# EasyEDA Pro project FrameworkGPU to MXM V0.31.epro, board V0.4
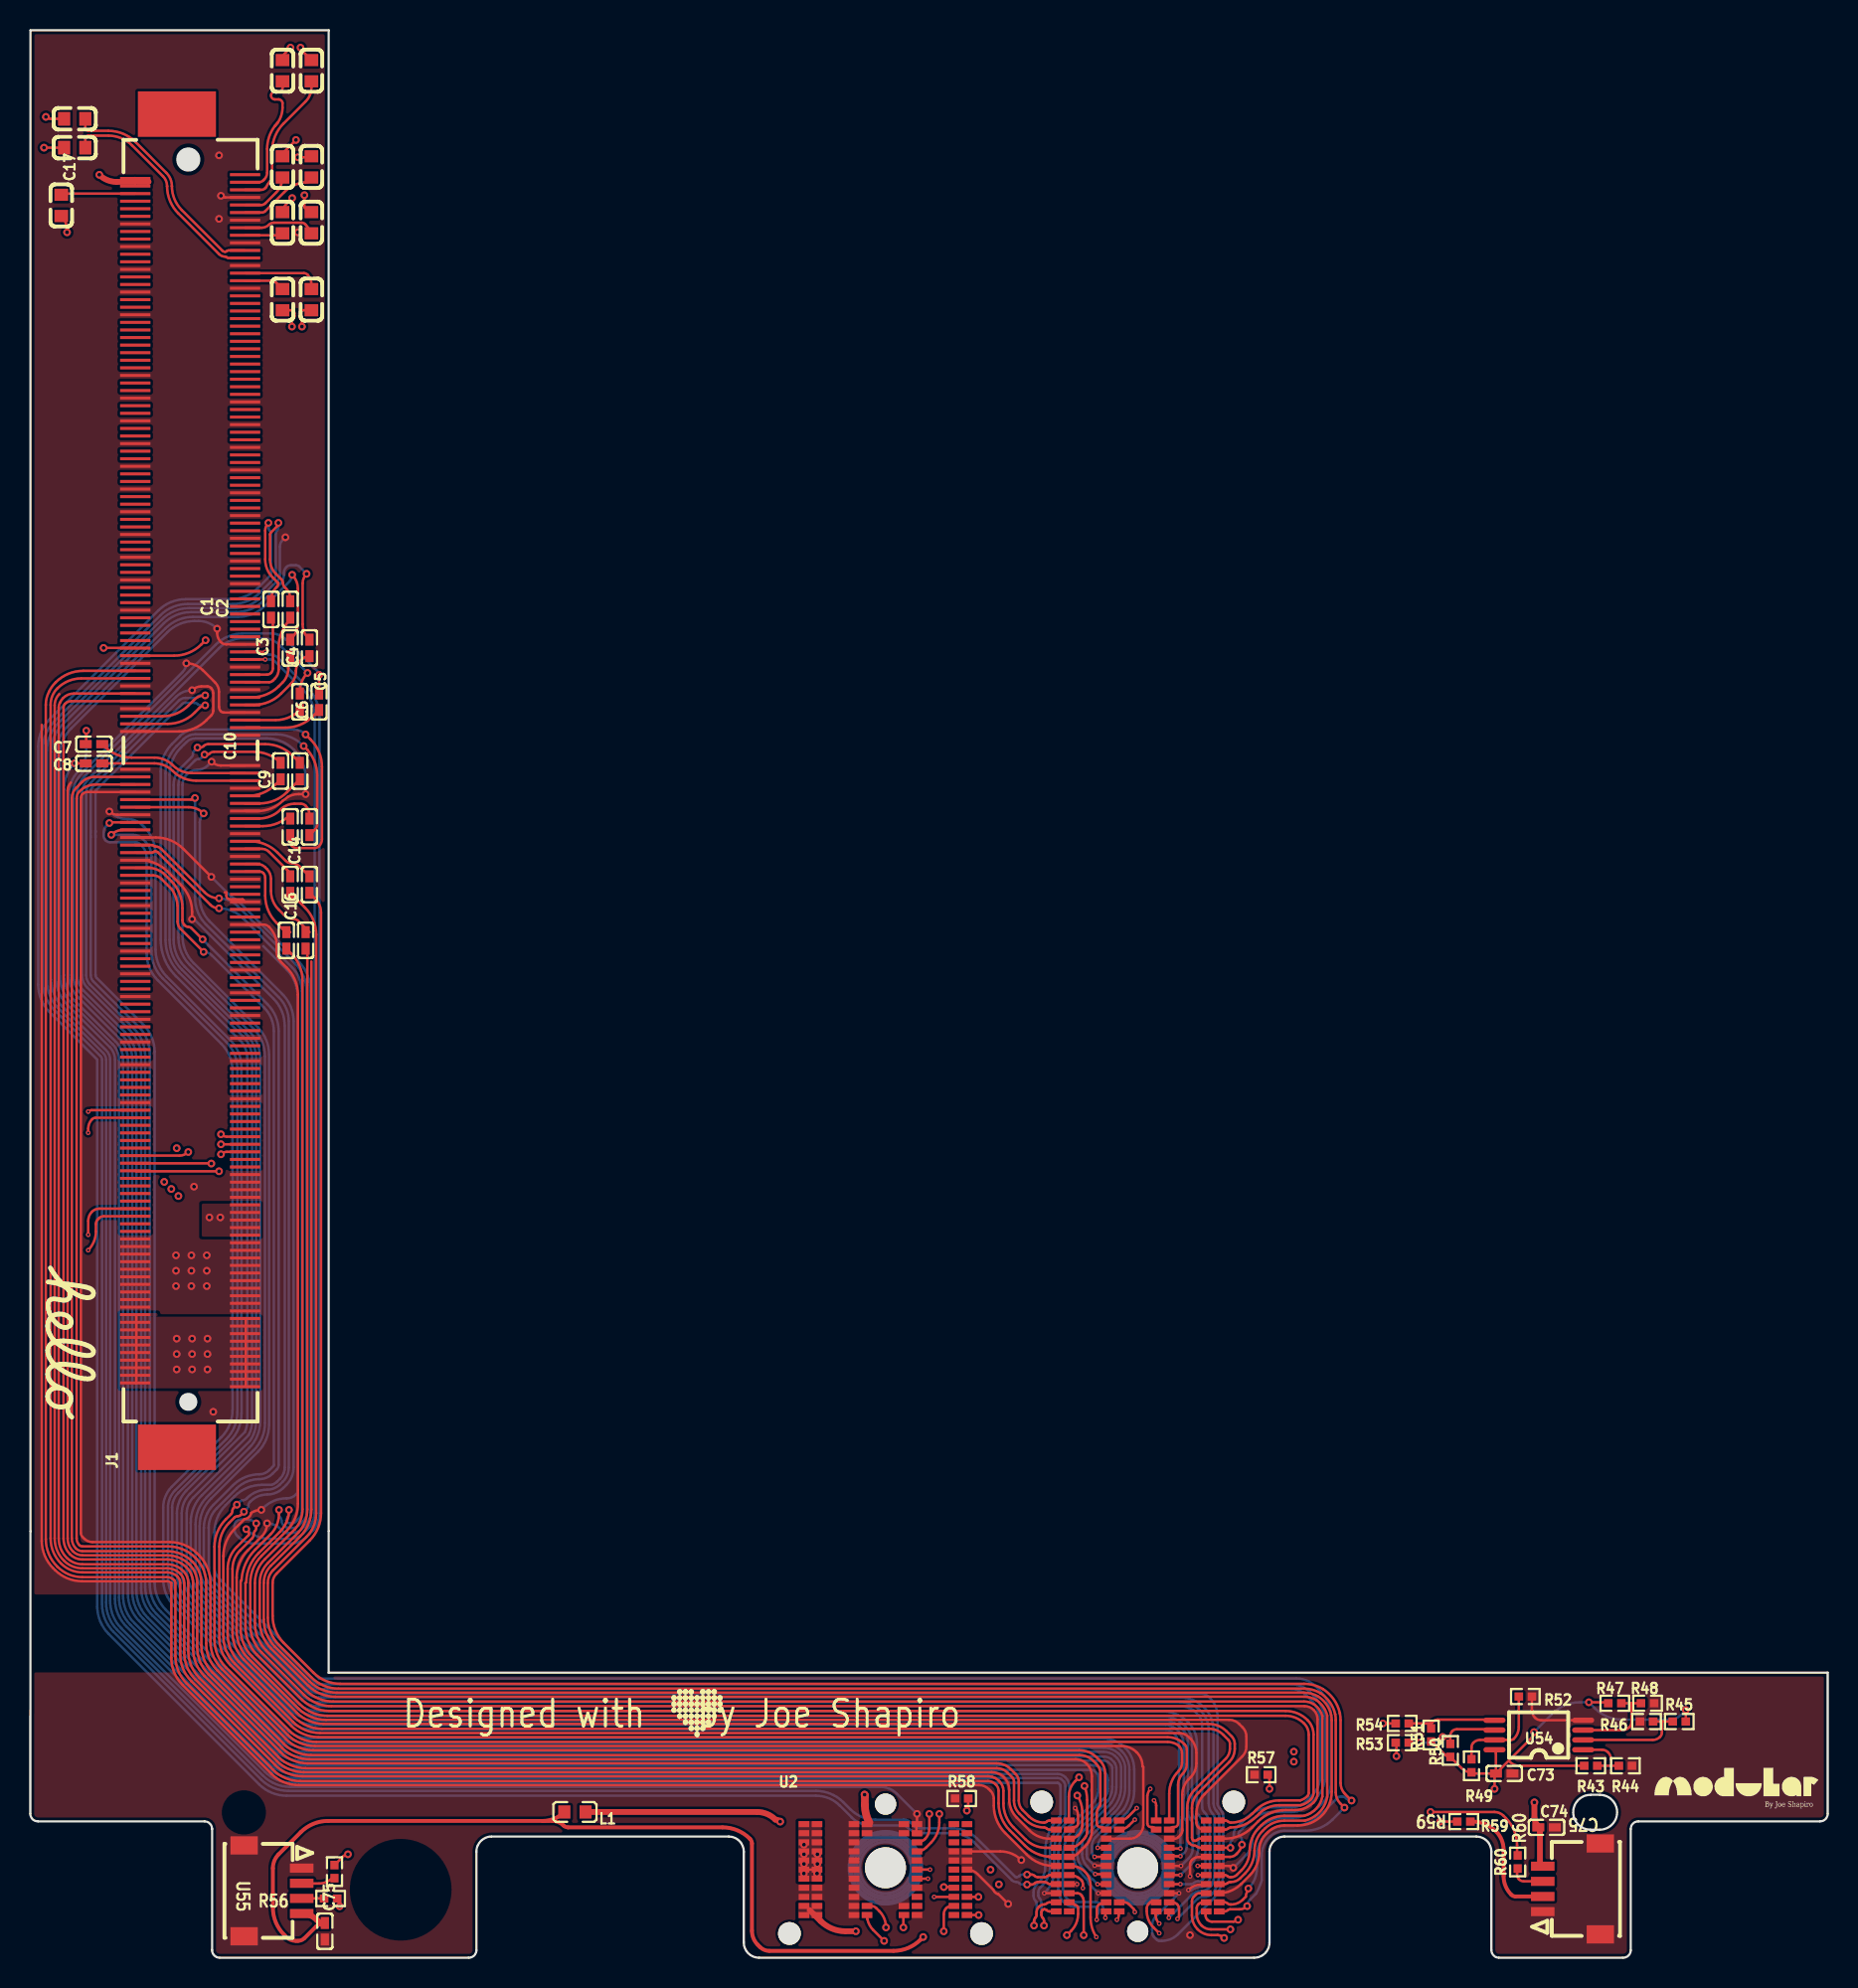
[diagram p7: board, top side]
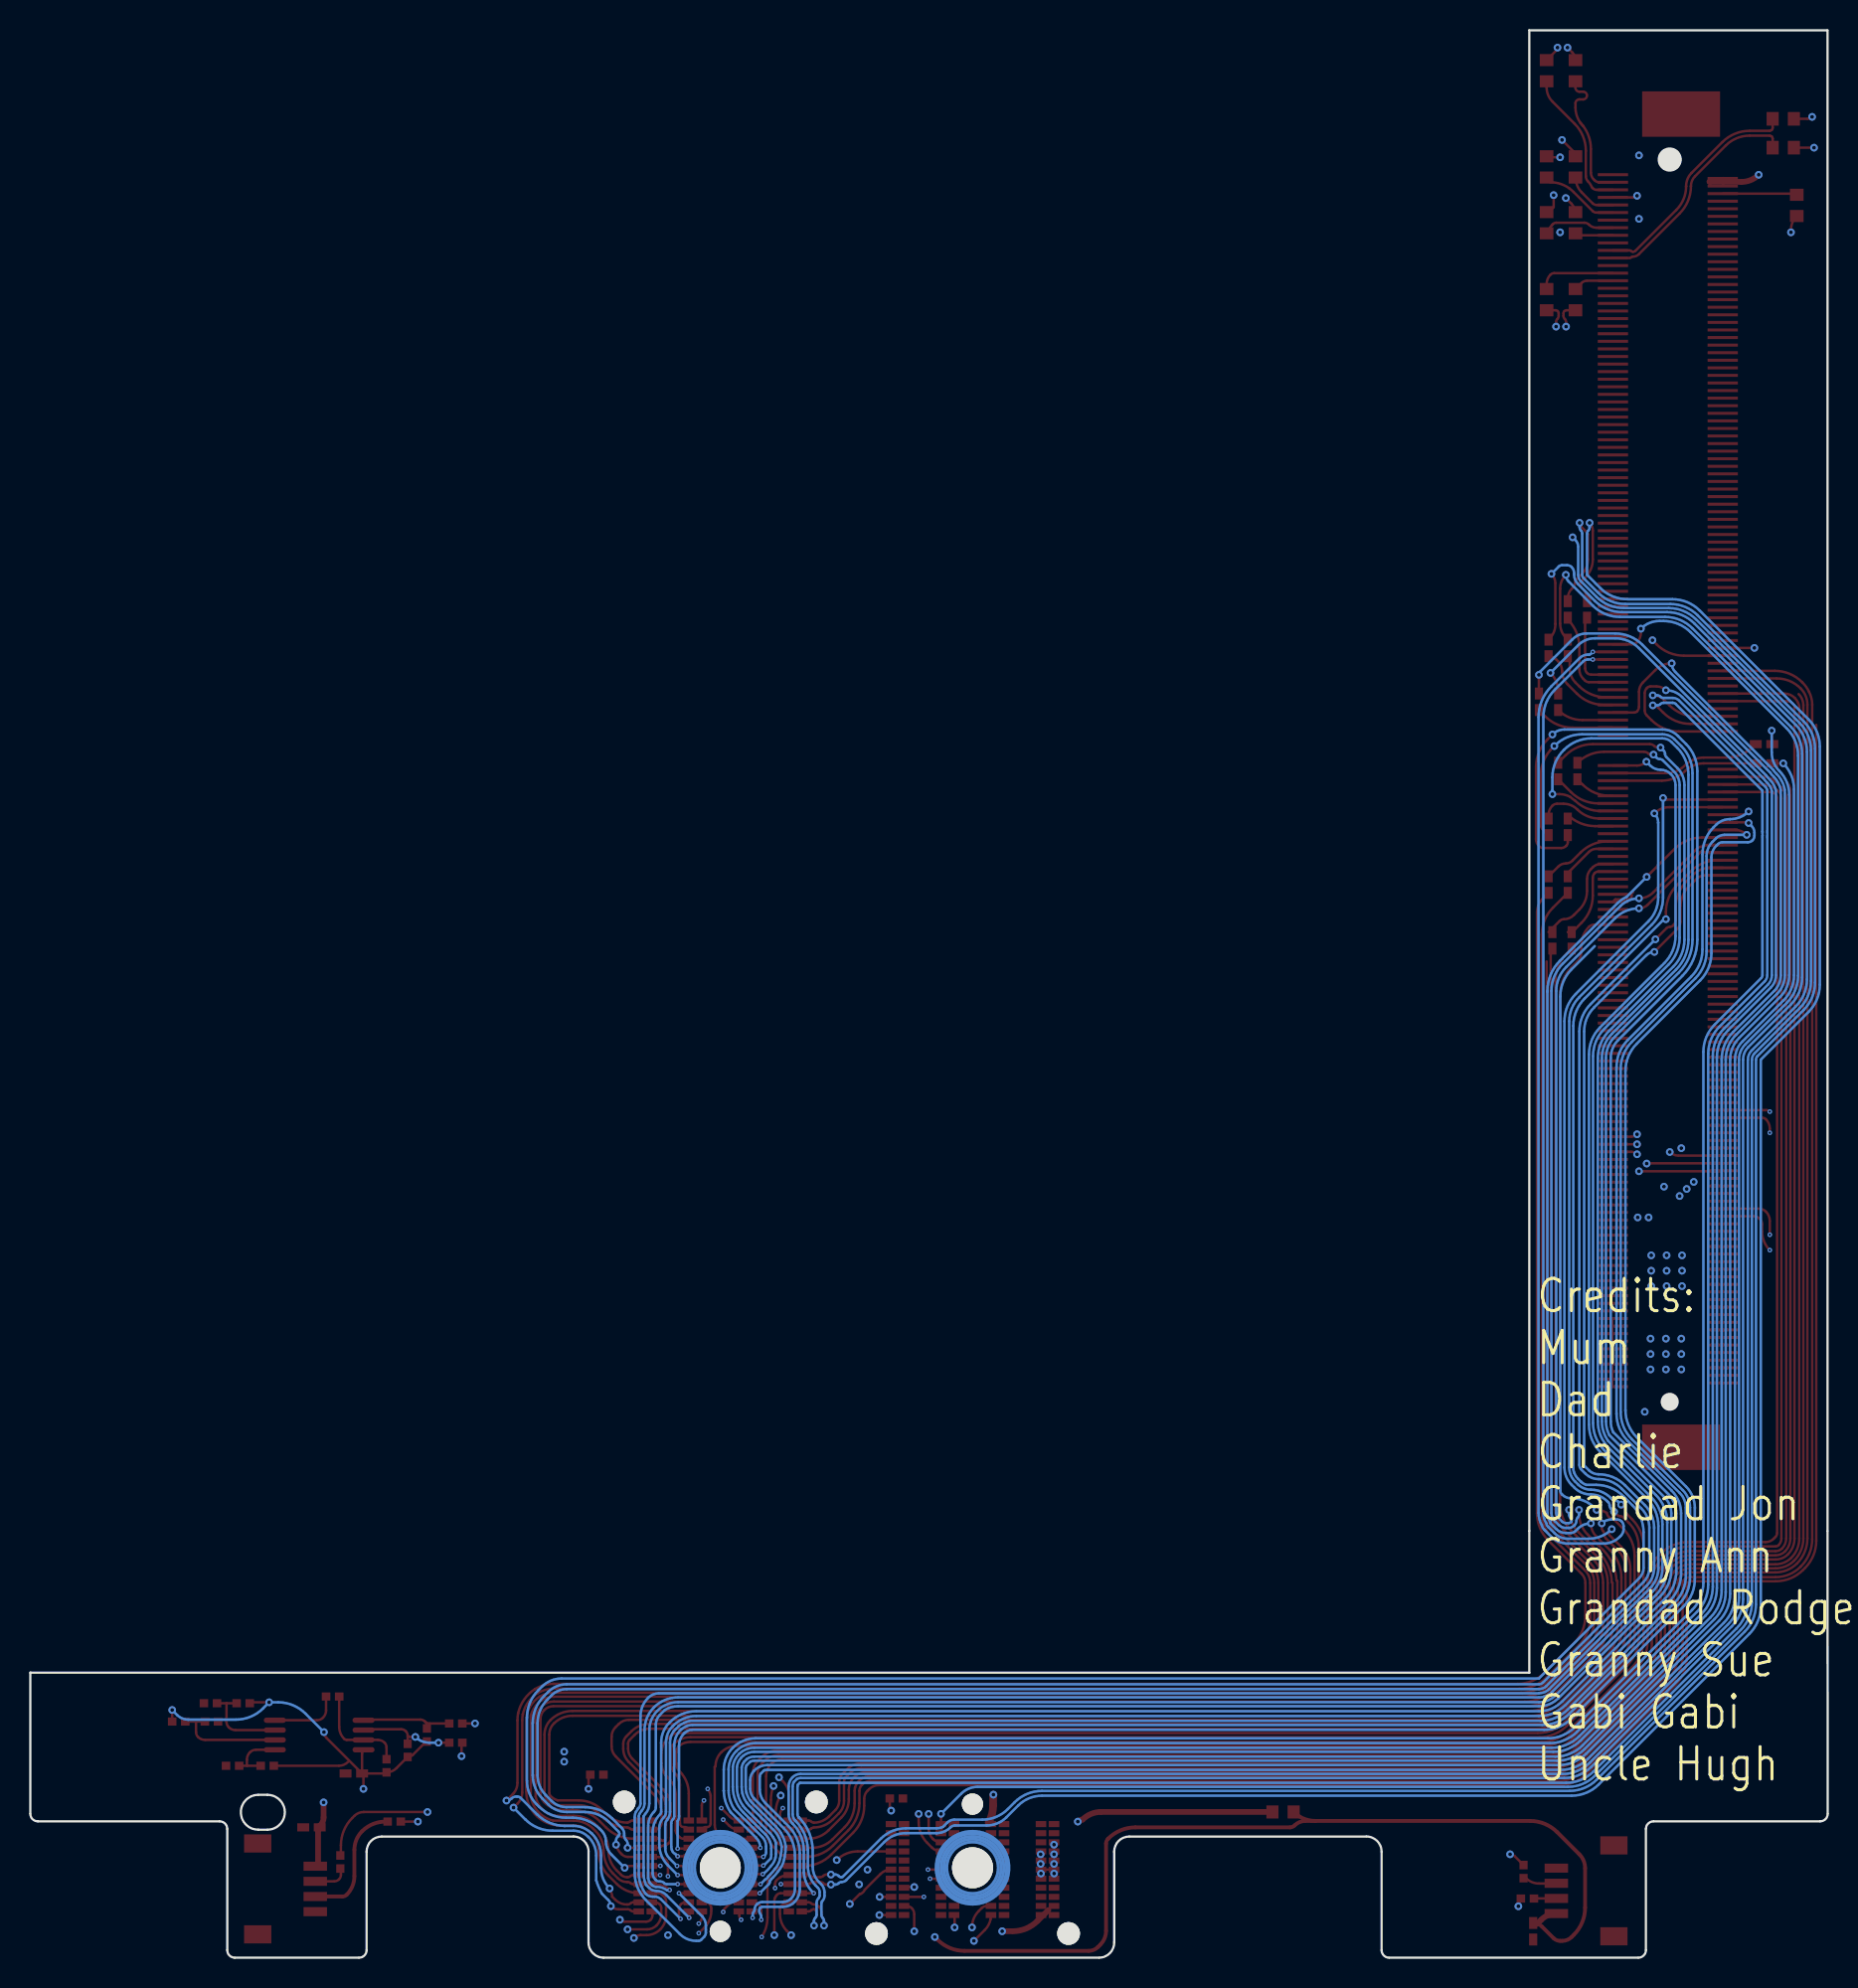
[diagram p8: board, bottom side, seen from below]

Outline 118.65 x 127.22 mm; copper layers: Top Layer, Inner2, Inner3, Bottom Layer. Coordinates in mm from the lower left corner of the outline.
Outline path: 0.01,127.22 0.01,28.16 0,9.5 arc(0.15,9.15) 0.5,9 11.5,9 arc(11.85,8.85) 12,8.5 12,0.5 arc(12.15,0.15) 12.5,0 28.95,0 arc(29.3,0.15) 29.45,0.5 29.45,7 arc(29.74,7.71) 30.45,8 46.1,8 arc(46.81,7.71) 47.1,7 47.1,1 arc(47.39,0.29) 48.1,0 80.8,0 arc(81.51,0.29) 81.8,1 81.8,7 arc(82.09,7.71) 82.8,8 95.45,8 arc(96.16,7.71) 96.45,7 96.45,0.5 arc(96.6,0.15) 96.95,0 105.15,0 arc(105.5,0.15) 105.65,0.5 105.65,8.5 arc(105.8,8.85) 106.15,9 118.15,9 arc(118.5,9.15) 118.65,9.5 118.65,18.82 19.7,18.82 arc(19.7,18.82) 19.7,18.82 19.7,127.22 0.01,127.22 ; 103,8.45 arc(101.85,9.6) 103,10.75 103.6,10.75 arc(104.75,9.6) 103.6,8.45 103,8.45
Stack: Top Layer 0.035mm / Dielectric1 0.48mm PP er 4.5 / Inner2 0.035mm / Dielectric2 0.48mm FR4 er 4.5 / Inner3 0.035mm / Dielectric3 0.48mm PP er 4.5 / Bottom Layer 0.035mm

## Design rules (mm)
net PCIE_TX_0P: PCIE_TX_0
net $1N3808: DP1
net PCIE_TX_0N: PCIE_TX_0
net $1N3802: DP1
net PCIE_TX_1P: PCIE_TX_1
net PCIE_TX_1N: PCIE_TX_1
net PCIE_TX_2P: PCIE_TX_2
net PCIE_TX_2N: PCIE_TX_2
net PCIE_TX_3P: PCIE_TX_3
net PCIE_TX_3N: PCIE_TX_3
net PCIE_TX_4P: PCIE_TX_4
net PCIE_TX_4N: PCIE_TX_4
net PCIE_TX_5P: PCIE_TX_5
net PCIE_TX_5N: PCIE_TX_5
net PCIE_TX_6P: PCIE_TX_6
net PCIE_TX_6N: PCIE_TX_6
net PCIE_TX_7P: PCIE_TX_7
net PCIE_TX_7N: PCIE_TX_7
net $1N13376: DP6
net DP_A_AUXP: DP_A_AUX
net $1N13406: DP6
net DP_A_AUXN: DP_A_AUX
net $1N13436: DP5
net DP_A_L3P: DP_A_L3
net $1N13548: DP5
net DP_A_L3N: DP_A_L3
net $1N13542: DP3
net DP_A_L2P: DP_A_L2
net $1N13608: DP3
net DP_A_L2N: DP_A_L2
net DP_A_L1P: DP_A_L1
net DP_A_L1N: DP_A_L1
net $1N13662: DP4
net DP_A_L0P: DP_A_L0
net $1N13722: DP4
net DP_A_L0N: DP_A_L0
net PEX_REFCLK+: DP2
net PEX_REFCLK-: DP2
net PCIE_RX_0P: PCIE_RX_0
net PCIE_RX_0N: PCIE_RX_0
net PCIE_RX_1P: PCIE_RX_1
net PCIE_RX_1N: PCIE_RX_1
net PCIE_RX_2P: PCIE_RX_2
net PCIE_RX_2N: PCIE_RX_2
net PCIE_RX_3P: PCIE_RX_3
net PCIE_RX_3N: PCIE_RX_3
net PCIE_RX_4P: PCIE_RX_4
net PCIE_RX_4N: PCIE_RX_4
net PCIE_RX_5P: PCIE_RX_5
net PCIE_RX_5N: PCIE_RX_5
net PCIE_RX_6P: PCIE_RX_6
net PCIE_RX_6N: PCIE_RX_6
net PCIE_RX_7P: PCIE_RX_7
net PCIE_RX_7N: PCIE_RX_7
template: Custom Config
spacing copperThickness1oz (default): track to track 0.102, other pairs 0.152 to 0.3
spacing copperThickness2oz: track to track 0.203, other pairs 0.152 to 0.3
track width copperThickness1oz (default): min 0.127, default 0.165, max 2.54
track width copperThickness2oz: min 0.203, default 0.254, max 2.54
differential pair differentialPair (default): width min 0.127, default 0.165, max 2.54; gap min 0.152, default 0.152
via viaSize (default): diameter min 0.251, default 0.508, max 10; hole min 0.15, default 0.254, max 6.3

## Placement (name value [footprint] x y rotation side)
C1  220nF  [C0402#2]  15.89 89 90 top
C2  220nF  [C0402#2]  17.16 89 90 top
C3  220nF  [C0402#2]  17.16 86.46 90 top
C4  220nF  [C0402#2]  18.43 86.46 90 top
C5  220nF  [C0402#2]  17.79 82.9 90 top
C6  220nF  [C0402#2]  19.06 82.9 90 top
C7  220nF  [C0402#2]  4.2 80.11 180 top
C8  220nF  [C0402#2]  4.2 78.84 180 top
C9  220nF  [C0402#2]  16.52 78.33 90 top
C10  220nF  [C0402#2]  17.79 78.33 90 top
C11  220nF  [C0402#2]  18.43 74.64 270 top
C12  220nF  [C0402#2]  17.16 74.64 270 top
C13  220nF  [C0402#2]  18.43 70.83 270 top
C14  220nF  [C0402#2]  17.16 70.83 270 top
C15  220nF  [C0402#2]  18.17 67.15 270 top
C16  220nF  [C0402#2]  16.9 67.15 270 top
C17  100nF  [C0603]  2.04 115.67 270 top
C18  100nF  [C0603]  16.65 124.56 90 top
C19  100nF  [C0603]  18.55 124.56 90 top
C20  100nF  [C0603]  16.65 118.21 90 top
C21  100nF  [C0603]  18.55 118.21 90 top
C22  100nF  [C0603]  18.55 114.52 90 top
C23  100nF  [C0603]  16.65 114.52 90 top
C24  100nF  [C0603]  2.93 121.38 180 top
C25  100nF  [C0603]  2.93 119.48 180 top
C26  100nF  [C0603]  18.55 109.44 270 top
C27  100nF  [C0603]  16.65 109.44 270 top
C73  0.1uF  [C0402]  97.29 12.16 180 top
C74  10uF  [C0402]  100.09 8.6 0 top
C75  10uF  [C0402]  19.44 1.75 270 top
J1  MXM3.0  [CONN-SMD_314P-P0.50_10151114-001TLF]  10.55 77.69 90 top
L1  100M  [L0603]  35.95 9.62 180 top
R43  0/NC  [R0402]  103.01 12.67 180 top
R44  0  [R0402]  105.3 12.67 180 top
R45  0/NC  [R0402]  108.85 15.59 0 top
R46  0  [R0402]  106.69 15.59 0 top
R47  0/NC  [R0402]  104.6 16.8 180 top
R48  0  [R0402]  106.76 16.8 180 top
R49  100K ±1%  [R0402]  95.14 12.67 270 top
R50  4.7K ±1%  [R0402]  93.74 13.68 270 top
R51  4.7K ±1%  [R0402]  92.47 14.7 270 top
R52  100K ±1%  [R0402]  98.69 17.24 180 top
R53  0  [R0402]  90.56 14.19 0 top
R54  0  [R0402]  90.56 15.46 0 top
R55  0  [R0402]  20.08 5.68 90 top
R56  0  [R0402]  19.82 3.91 0 top
R57  330k ±1%  [R0402]  81.25 12.08 0 top
R58  330k ±1%  [R0402]  61.48 10.51 0 top
R59  0  [R0402]  94.63 8.99 180 top
R60  0  [R0402]  98.18 6.32 90 top
U2  FXBeam  [FW_FXBEAM_FULL]  64.78 5.94 0 top
U54  BR24G32FVT-3GE2  [TSSOP-8_L4.4-W3.0-P0.65-LS6.4-BL]  99.58 14.7 90 top
U55  A1001WR-S-04P  [CONN-SMD_A1001WR-S-04P]  16.01 4.41 270 top
U56  A1001WR-S-04P  [CONN-SMD_A1001WR-S-04P]  101.74 4.54 90 top

## Footprints (pads in the part's own frame, mm; a bottom-side part is the same pattern mirrored in y, then rotated)
C0402
  rect 0.79x0.54 smd: 1(0.545,0) 2(-0.545,0)
C0402#2
  rect 0.79x0.54 smd: 1(-0.545,0) 2(0.545,0)
C0603
  rect 0.8x0.9 smd: 1(-0.7,0) 2(0.7,0)
CONN-SMD_314P-P0.50_10151114-001TLF
  rect 0.2x2 smd: 1(-30,-3.625) 2(-29.75,3.625) 3(-29.5,-3.625) 4(-29.25,3.625) 5(-29,-3.625) 6(-28.75,3.625) 7(-28.5,-3.625) 8(-28.25,3.625) 9(-28,-3.625) 10(-27.75,3.625) 11(-27.5,-3.625) 12(-27.25,3.625) 13(-27,-3.625) 14(-26.75,3.625) 15(-26.5,-3.625) 16(-26.25,3.625) 17(-26,-3.625) 18(-25.75,3.625) 19(-25.5,-3.625) 20(-25.25,3.625) 21(-25,-3.625) 22(-24.75,3.625) 23(-24.5,-3.625) 24(-24.25,3.625) 25(-24,-3.625) 26(-23.75,3.625) 27(-23.5,-3.625) 28(-23.25,3.625) 29(-23,-3.625) 30(-22.75,3.625) 31(-22.5,-3.625) 32(-22.25,3.625) 33(-22,-3.625) 34(-21.75,3.625) 35(-21.5,-3.625) 36(-21.25,3.625) 37(-21,-3.625) 38(-20.75,3.625) 39(-20.5,-3.625) 40(-20.25,3.625) 41(-20,-3.625) 42(-19.75,3.625) 43(-19.5,-3.625) 44(-19.25,3.625) 45(-19,-3.625) 46(-18.75,3.625) 47(-18.5,-3.625) 48(-18.25,3.625) 49(-18,-3.625) 50(-17.75,3.625) 51(-17.5,-3.625) 52(-17.25,3.625) 53(-17,-3.625) 54(-16.75,3.625) 55(-16.5,-3.625) 56(-16.25,3.625) 57(-16,-3.625) 58(-15.75,3.625) 59(-15.5,-3.625) 60(-15.25,3.625) 61(-15,-3.625) 62(-14.75,3.625) 63(-14.5,-3.625) 64(-14.25,3.625) 65(-14,-3.625) 66(-13.75,3.625) 67(-13.5,-3.625) 68(-13.25,3.625) 69(-13,-3.625) 70(-12.75,3.625) 71(-12.5,-3.625) 72(-12.25,3.625) 73(-12,-3.625) 74(-11.75,3.625) 75(-11.5,-3.625) 76(-11.25,3.625) 77(-11,-3.625) 78(-10.75,3.625) 79(-10.5,-3.625) 80(-10.25,3.625) 81(-10,-3.625) 82(-9.75,3.625) 83(-9.5,-3.625) 84(-9.25,3.625) 85(-9,-3.625) 86(-8.75,3.625) 87(-8.5,-3.625) 88(-8.25,3.625) 89(-8,-3.625) 90(-7.75,3.625) 91(-7.5,-3.625) 92(-7.25,3.625) 93(-7,-3.625) 94(-6.75,3.625) 95(-6.5,-3.625) 96(-6.25,3.625) 97(-6,-3.625) 98(-5.75,3.625) 99(-5.5,-3.625) 100(-5.25,3.625) 101(-5,-3.625) 102(-4.75,3.625) 103(-4.5,-3.625) 104(-4.25,3.625) 105(-4,-3.625) 106(-3.75,3.625) 107(-3.5,-3.625) 108(-3.25,3.625) 109(-3,-3.625) 110(-2.75,3.625) 111(-2.5,-3.625) 112(-2.25,3.625) 113(-2,-3.625) 114(-1.75,3.625) 115(-1.5,-3.625) 116(-1.25,3.625) 117(-1,-3.625) 118(-0.75,3.625) 119(-0.5,-3.625) 120(-0.25,3.625) 121(-0.001,-3.625) 122(0.25,3.625) 123(0.5,-3.625) 124(0.75,3.625) 125(1,-3.625) 133(3,-3.625) 134(3.249,3.625) 135(3.5,-3.625) 136(3.75,3.625) 137(4,-3.625) 138(4.25,3.625) 139(4.5,-3.625) 140(4.75,3.625) 141(5,-3.625) 142(5.25,3.625) 143(5.5,-3.625) 144(5.75,3.625) 145(6,-3.625) 146(6.25,3.625) 147(6.5,-3.625) 148(6.75,3.625) 149(7,-3.625) 150(7.25,3.625) 151(7.5,-3.625) 152(7.75,3.625) 153(8,-3.625) 154(8.25,3.625) 155(8.5,-3.625) 156(8.75,3.625) 157(9,-3.625) 158(9.25,3.625) 159(9.5,-3.625) 160(9.75,3.625) 161(10,-3.625) 162(10.25,3.625) 163(10.5,-3.625) 164(10.75,3.625) 165(11,-3.625) 166(11.25,3.625) 167(11.5,-3.625) 168(11.75,3.625) 169(12,-3.625) 170(12.25,3.625) 171(12.5,-3.625) 172(12.75,3.625) 173(13,-3.625) 174(13.25,3.625) 175(13.5,-3.625) 176(13.75,3.625) 177(14,-3.625) 178(14.25,3.625) 179(14.5,-3.625) 180(14.75,3.625) 181(15,-3.625) 182(15.25,3.625) 183(15.5,-3.625) 184(15.75,3.625) 185(16,-3.625) 186(16.25,3.625) 187(16.5,-3.625) 188(16.75,3.625) 189(17,-3.625) 190(17.25,3.625) 191(17.5,-3.625) 192(17.75,3.625) 193(18,-3.625) 194(18.25,3.625) 195(18.5,-3.625) 196(18.75,3.625) 197(19,-3.625) 198(19.25,3.625) 199(19.5,-3.625) 200(19.75,3.625) 201(20,-3.625) 202(20.25,3.625) 203(20.5,-3.625) 204(20.75,3.625) 205(21,-3.625) 206(21.25,3.625) 207(21.5,-3.625) 208(21.75,3.625) 209(22,-3.625) 210(22.25,3.625) 211(22.5,-3.625) 212(22.75,3.625) 213(23,-3.625) 214(23.25,3.625) 215(23.5,-3.625) 216(23.75,3.625) 217(24,-3.625) 218(24.25,3.625) 219(24.5,-3.625) 220(24.75,3.625) 221(25,-3.625) 222(25.25,3.625) 223(25.5,-3.625) 224(25.75,3.625) 225(26,-3.625) 226(26.25,3.625) 227(26.5,-3.625) 228(26.75,3.625) 229(27,-3.625) 230(27.25,3.625) 231(27.5,-3.625) 232(27.75,3.625) 233(28,-3.625) 234(28.25,3.625) 235(28.5,-3.625) 236(28.75,3.625) 237(29,-3.625) 238(29.25,3.625) 239(29.5,-3.625) 240(29.75,3.625) 241(30,-3.625) 242(30.25,3.625) 243(30.5,-3.625) 244(30.75,3.625) 245(31,-3.625) 246(31.25,3.625) 247(31.5,-3.625) 248(31.75,3.625) 249(32,-3.625) 250(32.25,3.625) 251(32.5,-3.625) 252(32.75,3.625) 253(33,-3.625) 254(33.25,3.625) 255(33.5,-3.625) 256(33.75,3.625) 257(34,-3.625) 258(34.25,3.625) 259(34.5,-3.625) 260(34.75,3.625) 261(35,-3.625) 262(35.25,3.625) 263(35.5,-3.625) 264(35.75,3.625) 265(36,-3.625) 266(36.25,3.625) 267(36.5,-3.625) 268(36.75,3.625) 269(37,-3.625) 270(37.25,3.625) 271(37.5,-3.625) 272(37.75,3.625) 273(38,-3.625) 274(38.25,3.625) 275(38.5,-3.625) 276(38.75,3.625) 277(39,-3.625) 278(39.25,3.625) 279(39.5,-3.625) 280(39.75,3.625) 281(40,-3.625) E1(-40,-3.625) E1(-39.5,-3.625) E1(-39,-3.625) E1(-38.5,-3.625) E1(-38,-3.625) E1(-37.5,-3.625) E1(-37,-3.625) E1(-36.5,-3.625) E1(-36,-3.625) E1(-35.5,-3.625) E2(-39.75,3.625) E2(-39.25,3.625) E2(-38.75,3.625) E2(-38.25,3.625) E2(-37.75,3.625) E2(-37.25,3.625) E2(-36.75,3.625) E2(-36.25,3.625) E2(-35.75,3.625) E2(-35.25,3.625) E3(-35,-3.625) E3(-34.5,-3.625) E3(-34,-3.625) E3(-33.5,-3.625) E3(-33,-3.625) E3(-32.5,-3.625) E3(-32,-3.625) E3(-31.5,-3.625) E3(-31,-3.625) E3(-30.5,-3.625) E4(-34.75,3.625) E4(-34.25,3.625) E4(-33.75,3.625) E4(-33.25,3.625) E4(-32.75,3.625) E4(-32.25,3.625) E4(-31.75,3.625) E4(-31.25,3.625) E4(-30.75,3.625) E4(-30.25,3.625)
  rect 3x5.15 smd: 282(44,0.875) 283(-44,0.875)
CONN-SMD_A1001WR-S-04P
  rect 0.6x1.55 smd: 1(-1.5,1.9) 2(-0.5,1.9) 3(0.5,1.9) 4(1.5,1.9)
  rect 1.2x1.8 smd: 5(3,-1.9) 6(-3,-1.9)
FW_FXBEAM_FULL
  round 1.5 hole 1.5: (-14.67,-4.34) (-1.99,-4.345) (1.98,4.34) (14.66,4.34)
  round 2.7 hole 2.7: (-8.33,0) (8.32,0)
  round 1.4 hole 1.4: (-8.325,4.2) (8.32,-4.2)
  rect 0.7x0.4 smd: PA1(-2.95,2.88) PA2(-3.81,2.88) PA3(-6.25,2.88) PA4(-7.11,2.88) PA5(-9.55,2.88) PA6(-10.41,2.88) PA7(-12.85,2.88) PA8(-13.71,2.88) PB1(-2.95,2.28) PB2(-3.81,2.28) PB3(-6.25,2.28) PB4(-7.11,2.28) PB5(-9.55,2.28) PB6(-10.41,2.28) PB7(-12.85,2.28) PB8(-13.71,2.28) PC1(-2.95,1.68) PC2(-3.81,1.68) PC3(-6.25,1.68) PC6(-10.41,1.68) PC7(-12.85,1.68) PC8(-13.71,1.68) PD1(-2.95,1.08) PD2(-3.81,1.08) PD3(-6.25,1.08) PD6(-10.41,1.08) PD7(-12.85,1.08) PD8(-13.71,1.08) PE1(-2.95,0.48) PE2(-3.81,0.48) PE3(-6.25,0.48) PE6(-10.41,0.48) PE7(-12.85,0.48) PE8(-13.71,0.48) PF1(-2.95,-0.12) PF2(-3.81,-0.12) PF3(-6.25,-0.12) PF6(-10.41,-0.12) PF7(-12.85,-0.12) PF8(-13.71,-0.12) PG1(-2.95,-0.72) PG2(-3.81,-0.72) PG3(-6.25,-0.72) PG6(-10.41,-0.72) PG7(-12.85,-0.72) PG8(-13.71,-0.72) PH1(-2.95,-1.32) PH2(-3.81,-1.32) PH3(-6.25,-1.32) PH6(-10.41,-1.32) PH7(-12.85,-1.32) PH8(-13.71,-1.32) PJ1(-2.95,-1.92) PJ2(-3.81,-1.92) PJ3(-6.25,-1.92) PJ6(-10.41,-1.92) PJ7(-12.85,-1.92) PJ8(-13.71,-1.92) PK1(-2.95,-2.52) PK2(-3.81,-2.52) PK3(-6.25,-2.52) PK4(-7.11,-2.52) PK5(-9.55,-2.52) PK6(-10.41,-2.52) PK7(-12.85,-2.52) PK8(-13.71,-2.52) PL1(-2.95,-3.12) PL2(-3.81,-3.12) PL3(-6.25,-3.12) PL4(-7.11,-3.12) PL5(-9.55,-3.12) PL6(-10.41,-3.12) PL7(-12.85,-3.12) PL8(-13.71,-3.12) SA1(13.7,3.12) SA2(12.84,3.12) SA3(10.4,3.12) SA4(9.54,3.12) SA5(7.1,3.12) SA6(6.24,3.12) SA7(3.8,3.12) SA8(2.94,3.12) SB1(13.7,2.52) SB2(12.84,2.52) SB3(10.4,2.52) SB4(9.54,2.52) SB5(7.1,2.52) SB6(6.24,2.52) SB7(3.8,2.52) SB8(2.94,2.52) SC1(13.7,1.92) SC2(12.84,1.92) SC3(10.4,1.92) SC6(6.24,1.92) SC7(3.8,1.92) SC8(2.94,1.92) SD1(13.7,1.32) SD2(12.84,1.32) SD3(10.4,1.32) SD6(6.24,1.32) SD7(3.8,1.32) SD8(2.94,1.32) SE1(13.7,0.72) SE2(12.84,0.72) SE3(10.4,0.72) SE6(6.24,0.72) SE7(3.8,0.72) SE8(2.94,0.72) SF1(13.7,0.12) SF2(12.84,0.12) SF3(10.4,0.12) SF6(6.24,0.12) SF7(3.8,0.12) SF8(2.94,0.12) SG1(13.7,-0.48) SG2(12.84,-0.48) SG3(10.4,-0.48) SG6(6.24,-0.48) SG7(3.8,-0.48) SG8(2.94,-0.48) SH1(13.7,-1.08) SH2(12.84,-1.08) SH3(10.4,-1.08) SH6(6.24,-1.08) SH7(3.8,-1.08) SH8(2.94,-1.08) SJ1(13.7,-1.68) SJ2(12.84,-1.68) SJ3(10.4,-1.68) SJ6(6.24,-1.68) SJ7(3.8,-1.68) SJ8(2.94,-1.68) SK1(13.7,-2.28) SK2(12.84,-2.28) SK3(10.4,-2.28) SK4(9.54,-2.28) SK5(7.1,-2.28) SK6(6.24,-2.28) SK7(3.8,-2.28) SK8(2.94,-2.28) SL1(13.7,-2.88) SL2(12.84,-2.88) SL3(10.4,-2.88) SL4(9.54,-2.88) SL5(7.1,-2.88) SL6(6.24,-2.88) SL7(3.8,-2.88) SL8(2.94,-2.88)
L0603
  rect 0.8x0.864 smd: 1(-0.7,0) 2(0.7,0)
R0402
  rect 0.566x0.54 smd: 1(-0.433,0) 2(0.433,0)
TSSOP-8_L4.4-W3.0-P0.65-LS6.4-BL
  oval 0.353x1.454 smd: 1(-0.975,-2.927) 2(-0.325,-2.927) 3(0.325,-2.927) 4(0.975,-2.927) 5(0.975,2.927) 6(0.325,2.927) 7(-0.325,2.927) 8(-0.975,2.927)

## Nets
12V_FAN: C74.2 C75.2 L1.2 U55.4 U56.4
+3.3V: C73.1 J1.278 J1.280 R43.2 R45.2 R47.2 R49.2 R50.2 R51.2 U2.PA4 U2.PA5 U2.PB4 U2.PB5 U54.8
+5V: J1.1 J1.3 J1.5 J1.7 J1.9 U2.PK7 U2.PK8 U2.PL7 U2.PL8
GND: C73.2 C74.1 C75.1 J1.11 J1.13 J1.15 J1.17 J1.36 J1.37 J1.46 J1.47 J1.52 J1.53 J1.58 J1.59 J1.64 J1.65 J1.70 J1.71 J1.76 J1.77 J1.82 J1.83 J1.88 J1.89 J1.94 J1.95 J1.100 J1.101 J1.106 J1.107 J1.112 J1.113 J1.118 J1.119 J1.124 J1.125 J1.133 J1.134 J1.139 J1.140 J1.145 J1.146 J1.151 J1.152 J1.157 J1.166 J1.173 J1.174 J1.179 J1.180 J1.185 J1.186 J1.191 J1.192 J1.197 J1.198 J1.203 J1.204 J1.209 J1.210 J1.215 J1.216 J1.221 J1.222 J1.228 J1.244 J1.250 J1.251 J1.256 J1.257 J1.262 J1.263 J1.268 J1.269 J1.275 J1.E3 J1.E4 R44.1 R46.1 R48.1 R52.1 R57.1 R58.1 U2.PA3 U2.PA6 U2.PB3 U2.PB6 U2.PC6 U2.PD1 U2.PD2 U2.PD6 U2.PE1 U2.PE2 U2.PE3 U2.PE6 U2.PF1 U2.PF6 U2.PG6 U2.PH3 U2.PH6 U2.PH7 U2.PH8 U2.PJ6 U2.PJ7 U2.PJ8 U2.PK4 U2.PK6 U2.PL3 U2.PL6 U2.SB2 U2.SB7 U2.SC1 U2.SC3 U2.SC6 U2.SC8 U2.SE2 U2.SE7 U2.SF1 U2.SF3 U2.SF6 U2.SF8 U2.SH2 U2.SH7 U2.SJ1 U2.SJ3 U2.SJ6 U2.SJ8 U54.4 U55.1 U55.5 U55.6 U56.1 U56.5 U56.6
VCC: J1.E1 J1.E2 U2.PA7 U2.PA8 U2.PB7 U2.PB8 U2.PC7 U2.PC8 U2.PD7 U2.PD8 U2.PE7 U2.PE8 U2.PF7 U2.PF8 U2.PG7 U2.PG8
BK_ADDR0: R43.1 R44.2 U54.1
BK_ADDR1: R45.1 R46.2 U54.2
BK_ADDR2: R47.1 R48.2 U54.3
BK_I2C_SCL: R53.1 U2.PC3
BK_I2C_SDA: R54.1 U2.PD3
DP_A_AUXN: C19.1 J1.277
DP_A_AUXP: C18.1 J1.279
DP_A_HPD: C17.1 J1.276
DP_A_L0N: C27.1 J1.253
DP_A_L0P: C26.1 J1.255
DP_A_L1N: C25.1 J1.259
DP_A_L1P: C24.1 J1.261
DP_A_L2N: C23.1 J1.265
DP_A_L2P: C22.1 J1.267
DP_A_L3N: C21.1 J1.271
DP_A_L3P: C20.1 J1.273
FAN1_PWM: R55.2 U2.PK5
FAN1_SPEED: R56.1 R56.2 U2.PJ2 U55.3
FAN2_PWM: R59.2 U2.PL5
FAN2_SPEED: R60.2 U2.PH2
PCIE_RX_0N: J1.148 U2.SD8
PCIE_RX_0P: J1.150 U2.SE8
PCIE_RX_1N: J1.142 U2.SA8
PCIE_RX_1P: J1.144 U2.SB8
PCIE_RX_2N: J1.136 U2.SD6
PCIE_RX_2P: J1.138 U2.SE6
PCIE_RX_3N: J1.120 U2.SA6
PCIE_RX_3P: J1.122 U2.SB6
PCIE_RX_4N: J1.114 U2.SB3
PCIE_RX_4P: J1.116 U2.SA3
PCIE_RX_5N: J1.108 U2.SE3
PCIE_RX_5P: J1.110 U2.SD3
PCIE_RX_6N: J1.102 U2.SB1
PCIE_RX_6P: J1.104 U2.SA1
PCIE_RX_7N: J1.96 U2.SD1
PCIE_RX_7P: J1.98 U2.SE1
PCIE_TX_0N: C2.2 U2.SG8
PCIE_TX_0P: C1.2 U2.SH8
PCIE_TX_1N: C4.2 U2.SK8
PCIE_TX_1P: C3.2 U2.SL8
PCIE_TX_2N: C6.2 U2.SH6
PCIE_TX_2P: C5.2 U2.SG6
PCIE_TX_3N: C8.2 U2.SK6
PCIE_TX_3P: C7.2 U2.SL6
PCIE_TX_4N: C10.2 U2.SL3
PCIE_TX_4P: C9.2 U2.SK3
PCIE_TX_5N: C12.2 U2.SG3
PCIE_TX_5P: C11.2 U2.SH3
PCIE_TX_6N: C14.2 U2.SL1
PCIE_TX_6P: C13.2 U2.SK1
PCIE_TX_7N: C16.2 U2.SG1
PCIE_TX_7P: C15.2 U2.SH1
PEX_CLK_REQ-: J1.154 U2.SA4
PEX_REFCLK+: J1.155 U2.SC2
PEX_REFCLK-: J1.153 U2.SD2
PEX_RST: J1.156 U2.SA5
PNL_BL_EN: J1.25 U2.SL4
PNL_BL_PWM: J1.27 U2.SK4
PNL_PWR_EN: J1.23 U2.SK5
PWR_EN: J1.8 U2.PK2
PWR_GOOD: J1.6 U2.PL1
PWR_LEVEL: J1.18 U2.SB4
SMB_CLK: J1.34 U2.PF3
SMB_DAT: J1.32 U2.PG3
TH_ALERT: J1.22 U2.SB5
TH_OVERT: J1.20 U2.SL5
TH_PWM: J1.24
$1N3802: C2.1 J1.147
$1N3808: C1.1 J1.149
$1N3862: C3.1 J1.143
$1N3868: C4.1 J1.141
$1N3922: C5.1 J1.137
$1N3928: C6.1 J1.135
$1N3982: C7.1 J1.123
$1N3988: C8.1 J1.121
$1N4042: C9.1 J1.117
$1N4048: C10.1 J1.115
$1N4102: C11.1 J1.111
$1N4108: C12.1 J1.109
$1N4162: C13.1 J1.105
$1N4168: C14.1 J1.103
$1N4222: C15.1 J1.99
$1N4228: C16.1 J1.97
$1N13346: C17.2 U2.SA7
$1N13376: C18.2 U2.SK7
$1N13406: C19.2 U2.SJ7
$1N13436: C20.2 U2.SG2
$1N13542: C22.2 U2.SK2
$1N13548: C21.2 U2.SF2
$1N13602: C24.2 U2.SD7
$1N13608: C23.2 U2.SJ2
$1N13662: C26.2 U2.SG7
$1N13668: C25.2 U2.SC7
$1N13722: C27.2 U2.SF7
$1N16911: R49.1 R52.2 U54.7
$1N16916: R50.1 R53.2 U54.6
$1N16922: R51.1 R54.2 U54.5
$1N17452: R55.1 U55.2
$1N17626: R57.2 U2.SL2
$1N19602: R58.2 U2.PJ1
$1N19683: R60.1 U56.3
$1N19689: R59.1 U56.2
$1N19713: L1.1 U2.PL4

Pads without a net: J1 2 4 10 12 14 16 19 21 26 28 29 30 31 33 35 38 39 40 41 42 43 44 45 48 49 50 51 54 55 56 57 60 61 62 63 66 67 68 69 72 73 74 75 78 79 80 81 84 85 86 87 90 91 92 93 158 159 160 161 162 163 164 165 167 168 169 170 171 172 175 176 177 178 181 182 183 184 187 188 189 190 193 194 195 196 199 200 201 202 205 206 207 208 211 212 213 214 217 218 219 220 223 224 225 226 227 229 230 231 232 233 234 235 236 237 238 239 240 241 242 243 245 246 247 248 249 252 254 258 260 264 266 270 272 274 281 282 283; U2 PA1 PA2 PB1 PB2 PC1 PC2 PF2 PG1 PG2 PH1 PJ3 PK1 PK3 PL2 SA2 SL7

## Via types
v1: diameter 0.508, hole 0.254, Top Layer to Bottom Layer, 151 vias
v2: diameter 0.305, hole 0.152, Top Layer to Bottom Layer, 42 vias

## Routing (per net, layer and track width the routed paths; a pad name or vN(x,y) marks a point on that pad's centre or on a via; arc(x,y) is an arc through that point)
12V_FAN: length 118
  Top Layer w0.254: 33.83,9.03 34.47,9.03 arc(34.86,8.95) 35.19,8.73 arc(35.33,8.64) 35.5,8.6 45.7,8.6 arc(46.67,8.41) 47.49,7.86 47.51,7.84 arc(47.6,7.7) 47.64,7.54 47.64,1.78 arc(47.74,1.28) 48.02,0.86 48.17,0.7 arc(48.45,0.52) 48.79,0.45 56.97,0.45 arc(57.94,0.64) 58.77,1.19 v1(58.94,1.37) ; 33.83,9.03 19.65,9.03 arc(18.68,8.84) 17.85,8.29 16.4,6.83 arc(16.11,6.4) 16.01,5.91 16.01,3.31 arc(16.21,2.33) 16.76,1.51 16.9,1.37 arc(17.18,1.18) 17.52,1.11 17.67,1.11 arc(17.9,1.16) 18.1,1.29 18.86,2.05 arc(19,2.16) 19.17,2.25 ; 33.83,9.03 arc(34.6,9.18) L1.2
  Top Layer w0.381: v1(99.29,10.25) 99.29,9.25 arc(99.34,8.97) 99.5,8.73 arc(99.61,8.56) 99.65,8.37 99.65,6.04 ; 19.44,2.29 arc(19.3,2.28) 19.17,2.25 18.92,2.5 arc(18.46,2.81) U55.4
  Inner3 w0.254: v1(99.29,10.25) 91.62,10.25 arc(90.65,10.45) 89.82,11 86.48,14.34 arc(85.66,14.89) 84.69,15.08 76.5,15.08 arc(75.53,14.89) 74.71,14.34 69.59,9.22 arc(68.77,8.67) 67.79,8.48 61.64,8.48 arc(60.67,8.28) 59.85,7.73 58.87,6.76 arc(58.32,5.93) 58.13,4.96 58.13,3.23 arc(58.32,2.26) 58.87,1.43 v1(58.94,1.37)
+3.3V: length 232.9
  Top Layer w0.165: 6.92,117.47 6.92,117 ; v1(96.66,11.14) 96.66,11.94 arc(96.68,12.06) 96.75,12.16 ; 96.75,12.16 95.32,12.16 arc(95.22,12.18) R49.2 arc(94.78,12.31) 94.48,12.5 R50.2 arc(93.55,13.29) 93.39,13.39 92.56,14.23 arc(92.52,14.26) R51.2 ; 96.75,12.16 96.75,13.49 arc(96.72,13.62) 96.65,13.73 ; 96.75,12.16 99.11,14.52 arc(99.22,14.69) v1(99.26,14.89) ; R43.2 98.29,12.67 arc(97.96,12.73) 97.68,12.92 ; v1(102.88,16.86) 104.01,16.86 arc(104.09,16.84) R47.2 ; R45.2 v1(109.28,16.35)
  Top Layer w0.381: 7.09,117.22 7.78,117.22 arc(7.79,117.22) 7.81,117.23 ; 6.92,117.22 5.69,117.22 arc(5.08,117.34) v1(4.56,117.69)
  Top Layer w0.508: 55.39,8.92 arc(55.17,9.47) 55.09,10.06 55.09,10.72 arc(55.09,10.74) v1(55.07,10.76)
  Inner3 w0.381: 49.85,18.33 91.98,18.33 arc(92.95,18.13) 93.78,17.58 95.92,15.44 arc(96.47,14.62) 96.66,13.65 v1(96.66,11.14) ; 49.85,18.33 21.24,18.33 arc(21.12,18.32) 21,18.3 arc(20.77,18.2) 20.57,18.05 arc(20.41,18.01) 20.25,18 20.06,18 arc(19.72,18.07) 19.44,18.26 arc(19.27,18.52) 19.21,18.83 19.21,54.22 arc(19.01,55.19) 18.46,56.02 9.32,65.16 arc(8.77,65.98) 8.58,66.95 8.58,112.63 arc(8.39,113.6) 7.83,114.43 4.59,117.67 ; 49.85,18.33 arc(50.83,18.13) 51.65,17.58 54.34,14.89 arc(54.89,14.07) 55.09,13.09 55.07,13.08 v1(55.07,10.76)
  Bottom Layer w0.165: v1(109.28,16.35) 108.96,16.02 arc(108.62,15.8) 108.22,15.72 105.08,15.72 arc(104.11,15.91) 103.28,16.46 v1(102.88,16.86) 102.28,16.86 arc(101.31,16.67) 100.49,16.12 v1(99.26,14.89)
+5V: length 89.1
  Top Layer w0.381: 51.45,3.14 52.17,2.43 arc(52.92,1.92) 53.81,1.75 v1(54.5,1.75)
  Inner3 w0.381: v1(11.82,48.86) v1(12.54,48.86) 15.42,48.86 arc(16.09,48.73) 16.65,48.36 17.94,47.07 arc(18.49,46.24) 18.68,45.27 18.68,18.8 arc(18.78,18.3) 19.06,17.88 19.43,17.51 arc(19.73,17.31) 20.08,17.24 20.53,17.24 arc(20.7,17.27) 20.84,17.37 arc(21.26,17.65) 21.76,17.75 49.66,17.75 arc(50.49,17.58) 51.19,17.11 53.5,14.81 arc(54.05,13.99) 54.24,13.01 54.24,2.36 arc(54.31,2.03) v1(54.5,1.75)
GND: length 3210.8
  Top Layer w0.165: v1(12.33,87.73) 12.33,87.45 arc(12.4,87.12) 12.59,86.84 arc(12.74,86.73) 12.93,86.69 J1.157 ; 18.55,65.75 18.55,29.6 arc(18.36,28.62) 17.81,27.8 15.88,25.87 arc(15.53,25.35) 15.41,24.73 15.41,22.32 arc(15.6,21.35) 16.16,20.53 18.44,18.24 arc(19.27,17.69) 20.24,17.49 84.09,17.49 arc(84.57,17.43) 85.02,17.24 arc(85.57,16.71) 85.88,16.02 arc(85.9,15.85) 85.91,15.67 85.91,10.96 arc(85.26,9.38) 83.68,8.73 82.78,8.73 arc(82.19,8.61) 81.69,8.28 81.58,8.16 arc(81.24,7.67) 81.13,7.08 81.13,6.96 arc(80.96,6.13) 80.49,5.43 79.94,4.88 arc(79.25,4.42) 78.44,4.26 ; 68.62,6.69 U2.SE7 arc(68.91,6.72) 69.18,6.9 69.66,7.38 arc(69.97,7.85) 70.08,8.4 70.08,11.97 arc(69.99,12.42) 69.74,12.8 arc(69.4,13.02) 69,13.1 18.42,13.1 arc(17.45,13.29) 16.62,13.85 11.76,18.71 arc(11.21,19.53) 11.02,20.5 11.02,24.73 arc(10.89,25.39) 10.52,25.94 arc(9.83,26.4) 9.03,26.56 3.44,26.56 arc(3.11,26.63) 2.82,26.82 arc(2.56,27.21) 2.47,27.68 2.47,77.05 arc(2.52,77.33) 2.68,77.57 ; J1.275 12.85,116.19 arc(12.71,116.22) v1(12.59,116.3) ; U2.SB7 68.68,8.56 arc(68.75,8.61) 68.84,8.62 68.93,8.62 arc(69.1,8.69) 69.17,8.86 69.17,9.41 arc(69.12,9.66) v2(68.97,9.87) ; v2(70.26,6.08) 71,6.08 U2.SF6 ; J1.100 7.26,72.44 arc(8.23,72.25) 9.05,71.7 9.94,70.82 arc(10.49,69.99) 10.68,69.02 v1(10.68,68.55) ; v1(58.53,9.49) U2.PA3 ; U2.SF3 v2(75.96,6.06) ; v1(11.95,71.34) 10.09,73.2 arc(9.27,73.75) 8.3,73.94 J1.106 ; J1.118 3.78,76.94 arc(3.6,76.91) 3.44,76.8 arc(3.37,76.69) 3.34,76.56 3.34,28.04 arc(3.37,27.9) 3.45,27.78 3.57,27.65 arc(3.81,27.49) 4.1,27.43 9.21,27.43 arc(10.18,27.24) 11.01,26.69 11.15,26.55 arc(11.7,25.72) 11.89,24.75 11.89,20.87 arc(12.09,19.89) 12.64,19.07 16.98,14.72 arc(17.81,14.17) 18.78,13.98 72.03,13.98 arc(72.57,13.87) 73.04,13.56 arc(73.32,13.14) 73.42,12.64 73.47,12.59 73.47,8.76 arc(73.4,8.43) 73.22,8.15 73.16,8.1 arc(72.9,7.92) 72.59,7.86 U2.SC6 ; v1(64.55,3.55) 63.89,4.21 63.84,4.21 arc(63.68,4.32) 63.57,4.49 62.52,5.53 arc(62.2,5.74) U2.PF1 ; 0.76,81.38 0.76,27.52 arc(0.95,26.55) 1.5,25.72 1.63,25.59 arc(2.45,25.04) 3.42,24.85 9.03,24.85 arc(9.18,24.82) 9.31,24.73 9.31,19.8 arc(9.5,18.82) 10.05,18 15.92,12.14 arc(16.74,11.59) 17.71,11.39 62.62,11.39 arc(62.98,11.32) 63.28,11.12 63.39,11.02 arc(63.55,10.78) 63.6,10.5 63.6,10.04 arc(63.79,9.06) 64.34,8.24 65.79,6.8 arc(66.61,6.25) 67.58,6.06 67.68,6.06 ; J1.83 15.39,68.19 arc(15.59,68.15) 15.76,68.04 arc(16.14,67.48) 16.27,66.81 16.27,66.37 arc(16.33,66.04) 16.52,65.75 16.92,65.36 arc(17.47,64.53) 17.67,63.56 17.67,29.98 arc(17.47,29) 16.92,28.18 15.26,26.52 arc(14.71,25.7) 14.52,24.73 14.52,21.95 arc(14.72,20.98) 15.27,20.16 18.07,17.35 arc(18.9,16.8) 19.87,16.61 84.11,16.61 arc(84.44,16.54) 84.72,16.35 arc(84.91,16.07) 84.98,15.74 84.98,10.87 arc(84.91,10.54) 84.72,10.26 arc(84.16,9.88) 83.49,9.75 82.85,9.75 arc(81.88,9.55) 81.06,9 80.65,8.6 arc(79.83,8.05) 78.86,7.86 U2.SC1 ; v2(76.56,5.37) 76.56,6.13 arc(76.59,6.31) 76.69,6.46 arc(76.9,6.6) 77.15,6.65 77.63,6.65 ; J1.113 15.02,75.69 arc(15.92,75.87) 16.68,76.38 arc(16.84,76.49) 17,76.62 arc(17.34,76.76) 17.71,76.8 v1(18.17,76.8) ; J1.134 9.83,80.94 arc(10.8,81.14) 11.63,81.69 11.95,82.01 arc(12.04,82.15) 12.08,82.32 12.08,83.48 arc(12.04,83.65) 11.95,83.79 11.91,83.83 arc(11.81,83.89) 11.7,83.92 11.29,83.92 arc(10.96,83.85) v1(10.68,83.66) ; 78.44,6.06 79.13,6.06 arc(79.28,6.02) v1(79.42,5.94) ; 77.67,4.82 77.31,4.82 arc(76.84,4.74) v2(76.45,4.47) ; U2.SJ6 v2(70.5,4.26) ; R52.1 99.12,16.33 arc(99.18,16.07) 99.33,15.84 arc(99.51,15.72) 99.73,15.68 U54.4 ; 67.68,7.86 67.28,7.86 arc(66.57,8) 65.96,8.41 65.13,9.24 arc(64.75,9.8) 64.62,10.46 64.62,11.08 arc(64.53,11.53) 64.27,11.91 arc(63.9,12.16) 63.46,12.24 18.06,12.24 arc(17.09,12.44) 16.27,12.99 10.91,18.35 arc(10.35,19.18) 10.16,20.15 10.16,24.73 arc(10.1,25.06) 9.91,25.34 arc(9.51,25.61) 9.03,25.7 3.44,25.7 arc(2.78,25.83) 2.22,26.21 arc(1.77,26.88) 1.61,27.68 1.61,82.66 arc(1.69,83.07) 1.92,83.41 ; 75.14,7.86 75.54,7.86 arc(75.67,7.88) 75.78,7.96 75.92,8.09 arc(76.01,8.24) 76.05,8.4 76.05,10.76 arc(76.16,11.31) 76.47,11.78 76.59,11.91 arc(76.88,12.33) 76.97,12.83 76.97,13.53 arc(76.88,14.02) 76.59,14.45 76.48,14.56 arc(76.18,14.76) 75.83,14.83 19.13,14.83 arc(18.16,15.02) 17.34,15.57 13.49,19.42 arc(12.94,20.25) 12.74,21.22 12.74,26.51 arc(12.94,27.48) 13.49,28.3 14.14,28.95 arc(14.43,29.08) 14.59,29.36 arc(14.91,29.51) v1(15.25,29.56) ; U2.SH7 v2(69.1,4.86) ; U2.PD1 64.04,7.02 arc(64.78,6.87) v1(65.42,6.45) ; 58.49,8.22 58.49,8.82 ; U2.SJ3 v2(75.83,4.26) ; J1.112 5.75,75.44 arc(5.46,75.5) v1(5.22,75.66) ; J1.139 12.76,82.19 arc(12.67,82.21) 12.59,82.26 arc(12.49,82.41) 12.46,82.57 12.46,83.56 arc(12.39,83.89) 12.2,84.17 11.38,84.99 arc(10.89,85.32) v1(10.3,85.44) ; J1.125 12.58,78.69 arc(12.25,78.76) v1(11.97,78.95) ; U2.SB2 77.46,8.46 arc(77.26,8.5) 77.1,8.6 arc(77.01,8.75) 76.97,8.91 76.97,9.49 arc(77.11,10.2) 77.51,10.79 80.01,13.29 arc(80.21,13.59) 80.28,13.94 80.28,14.6 arc(80.21,14.93) 80.02,15.21 79.81,15.42 arc(79.5,15.63) 79.13,15.7 19.5,15.7 arc(18.52,15.9) 17.7,16.45 14.36,19.78 arc(13.81,20.61) 13.62,21.58 13.62,25.1 arc(13.81,26.07) 14.36,26.89 15.27,27.8 arc(15.54,28.2) v1(15.63,28.67) ; U2.SJ8 v2(66.93,4.26) ; J1.89 14.04,69.83 arc(14.03,69.84) 14.01,69.86 13.18,69.86 arc(13.01,69.93) 12.94,70.09 12.94,70.29 arc(12.94,70.31) 12.95,70.32 arc(12.89,70.33) 12.84,70.33
  Inner2 w0.165: v2(69.1,4.86) 69.1,5.39 arc(69.29,6.37) 69.84,7.19 70.5,7.84 arc(71.06,8.22) 71.72,8.35 71.89,8.35 arc(72.5,8.45) 73.03,8.75 arc(73.05,8.75) 73.06,8.76 arc(73.18,8.84) 73.27,8.96 73.75,9.44 arc(73.95,9.57) 74.18,9.62 74.26,9.62 arc(74.42,9.65) 74.56,9.75 arc(74.66,9.89) 74.69,10.05 74.69,14.6 arc(74.54,15.02) 74.29,15.41 74.07,15.63 arc(73.86,15.73) 73.64,15.77 19.68,15.77 arc(18.71,15.96) 17.89,16.51 17.38,17.01 arc(16.93,17.69) 16.78,18.48 16.78,21.52 arc(16.58,22.49) 16.03,23.32 12.82,26.53 arc(12.27,27.35) 12.08,28.33 12.08,30.16 arc(12.27,31.13) 12.82,31.95 16.08,35.22 arc(16.63,36.04) 16.83,37.01 16.83,73.21 arc(16.69,73.93) 16.29,74.55 15.09,75.75 ; 76.34,10.13 76.34,15.3 arc(76.24,15.8) 75.96,16.22 arc(75.5,16.53) 74.95,16.64 20.25,16.64 arc(19.18,16.86) 18.27,17.47 18.14,17.59 arc(17.83,18.06) 17.72,18.62 17.72,74.13 arc(17.69,74.22) 17.66,74.3 arc(17.6,74.41) 17.53,74.51 arc(17.48,74.57) 17.43,74.63 13.69,78.37 13.69,79.22 arc(13.69,79.25) 13.69,79.27 13.69,85.55 arc(13.68,85.69) 13.69,85.84 13.69,86.05 arc(13.68,86.19) 13.69,86.34 13.69,110.83 arc(13.88,111.8) 14.43,112.62 15.41,113.6 arc(15.73,113.81) 16.1,113.89 v1(17.67,113.89) ; v1(10.81,50.9) 10.55,51.16 arc(9.85,51.62) 9.03,51.78 arc(8.56,51.69) 8.16,51.43 8,51.27 arc(7.45,50.44) 7.26,49.47 7.26,25.05 arc(7.45,24.08) 8,23.25 16.99,14.26 arc(17.82,13.71) 18.79,13.52 67.32,13.52 arc(67.48,13.49) 67.61,13.4 67.64,13.37 arc(67.66,13.35) 67.68,13.33 arc(67.78,13.15) 67.82,12.94 67.82,11.51 arc(67.9,11.07) 68.15,10.69 v2(68.97,9.87) ; v1(64.55,3.55) 64.55,4.37 arc(64.54,4.4) 64.53,4.43 arc(64.47,4.66) 64.45,4.9 64.45,5.18 arc(64.36,5.66) 64.08,6.06 arc(64.06,6.08) 64.05,6.1 arc(63.67,6.7) 63.54,7.39 63.54,9.64 arc(63.54,9.67) 63.53,9.71 63.53,10.21 arc(63.46,10.58) 63.26,10.89 63.17,10.97 arc(62.84,11.19) 62.45,11.29 62.45,11.29 17.94,11.29 arc(16.88,11.51) 15.99,12.11 5.84,22.27 arc(5.24,23.17) 5.03,24.24 5.03,66.42 arc(5.23,67.39) 5.78,68.22 11.94,74.38 arc(12.15,74.82) 12.25,75.3 12.25,76.27 arc(12.08,76.94) 11.68,77.52 9.78,79.42 arc(9.17,80.33) 8.95,81.41 8.95,87.01 arc(9.13,87.89) 9.63,88.65 11.3,90.32 arc(11.72,90.95) 11.87,91.7 11.87,112.87 arc(11.78,113.35) 11.51,113.76 11.41,113.86 arc(11.1,114.33) 10.98,114.88 10.98,115.79 arc(11.15,116.6) 11.61,117.29 11.88,117.56 arc(12.31,118.21) v1(12.46,118.97) ; v2(76.56,5.37) 76.85,5.08 arc(77.03,4.96) 77.23,4.92 arc(77.46,4.97) 77.66,5.1 77.86,5.3 arc(78.33,6.01) 78.5,6.84 78.5,9.03 arc(78.37,9.69) 77.99,10.26 77.98,10.26 arc(77.52,10.96) 77.36,11.78 77.36,15.71 arc(77.19,16.54) 76.72,17.24 arc(76.44,17.43) 76.11,17.49 20.34,17.49 arc(20.07,17.51) 19.81,17.57 arc(19.39,17.71) 19.03,17.97 arc(18.98,18.02) 18.94,18.07 arc(18.69,18.51) 18.61,19 18.61,73.85 arc(18.56,74.26) 18.43,74.65 arc(18.33,74.84) 18.21,75.02 arc(18.13,75.13) 18.03,75.23 14.54,78.72 14.54,79.22 arc(14.54,79.26) 14.54,79.3 14.54,85.59 arc(14.54,85.69) 14.54,85.8 14.54,86.09 arc(14.54,86.19) 14.54,86.3 14.54,110.47 arc(14.73,111.45) 15.28,112.27 16.01,113 16.64,113 arc(16.89,112.95) 17.1,112.81 17.29,112.62 arc(17.48,112.49) 17.7,112.45 arc(18.08,112.52) 18.39,112.74 18.46,112.8 arc(19.01,113.62) 19.2,114.6 19.2,118.28 arc(19.01,119.26) 18.46,120.08 17.92,120.62 arc(17.78,120.71) 17.61,120.75 17.41,120.75 arc(17.18,120.7) 16.98,120.57 16.9,120.49 arc(16.43,119.79) 16.27,118.96 16.27,117.47 arc(16.17,116.98) 15.89,116.55 15.87,116.53 arc(15.47,116.27) 15,116.17 12.89,116.17 arc(12.73,116.21) v1(12.59,116.3) ; 15.09,75.76 13.01,77.84 arc(12.88,78.03) 12.84,78.25 12.84,79.22 arc(12.84,79.23) 12.84,79.25 12.84,80.45 arc(12.84,80.47) 12.83,80.49 12.83,85.57 arc(12.83,85.7) 12.84,85.83 12.84,86.06 arc(12.83,86.19) 12.84,86.32 12.84,113.87 arc(12.74,114.36) v1(12.46,114.78) ; 5.89,49.12 5.89,24.48 arc(6.08,23.51) 6.63,22.68 16.43,12.89 arc(17.25,12.34) 18.22,12.15 63.53,12.15 arc(63.76,12.1) 63.96,11.97 arc(64.28,11.5) 64.39,10.93 64.39,8.96 arc(64.47,8.53) 64.72,8.16 64.93,7.95 arc(65.09,7.71) 65.15,7.44 65.15,7.1 arc(65.22,6.75) v1(65.42,6.45) ; v1(12.08,36.04) 12.52,35.6 arc(13.01,35.26) 13.6,35.15 13.9,35.15 arc(14.08,35.18) 14.23,35.28 14.89,35.94 arc(15.33,36.61) 15.49,37.4 15.49,42.27 arc(15.48,42.31) 15.46,42.34 15.46,48.17 arc(15.45,48.24) 15.44,48.31 arc(15.41,48.42) 15.38,48.52 arc(15.36,48.56) 15.35,48.6
  Inner3 w0.165: 5.85,37.57 5.85,42.64 arc(5.86,42.64) 5.86,42.64 10.93,42.64
  Bottom Layer w0.165: v1(11.97,78.95) 11.71,78.69 arc(11.4,78.48) 11.04,78.41 arc(10.67,78.34) 10.36,78.13 10.34,78.12 arc(10.12,77.79) 10.05,77.4 10.05,67.44 arc(10.24,66.47) 10.79,65.65 15.02,61.42 arc(15.57,60.59) 15.76,59.62 15.76,35.18 arc(15.57,34.21) 15.02,33.39 11.92,30.29 arc(11.37,29.47) 11.18,28.5 11.18,25.75 arc(11.33,24.99) 11.76,24.35 18.37,17.74 arc(18.69,17.53) 19.06,17.45 77.16,17.45 arc(77.54,17.38) 77.86,17.16 arc(78.24,16.6) 78.37,15.93 78.37,10.18 arc(78.4,10.02) 78.5,9.87 arc(78.52,9.85) 78.54,9.83 arc(78.6,9.73) 78.67,9.63 arc(78.73,9.45) 78.75,9.26 78.75,7.39 arc(78.73,7.26) 78.75,7.12 78.75,5.59 arc(78.56,4.62) 78.01,3.8 75.77,1.56 arc(75.28,1.23) 74.69,1.11 74.52,1.11 arc(74.44,1.13) 74.37,1.18 74.18,1.37 arc(74.09,1.49) 74.05,1.64 arc(74.06,1.74) 74.05,1.85 74.05,2.13 arc(74.12,2.45) 74.3,2.73 v2(75.83,4.26) ; v2(70.5,4.26) 69.89,4.86 arc(69.86,4.92) 69.84,4.98 69.84,5.04 arc(69.78,5.12) 69.73,5.2 69.61,5.32 arc(69.45,5.49) 69.3,5.68 arc(69.04,6.05) 68.89,6.48 arc(68.87,6.57) 68.86,6.67 arc(68.8,6.98) 68.78,7.3 68.78,7.32 arc(68.78,7.33) 68.79,7.35 arc(68.89,7.8) 69.09,8.23 arc(69.24,8.44) 69.42,8.64 71.04,10.26 arc(71.08,10.32) 71.13,10.37 arc(71.13,10.38) 71.14,10.39 arc(71.28,10.62) 71.37,10.87 arc(71.38,10.9) 71.39,10.93 arc(71.41,11.1) 71.42,11.27 71.42,12.54 arc(71.4,12.61) 71.37,12.69 71.11,12.95 arc(70.99,12.99) 70.86,13.01 17.87,13.01 arc(16.9,13.2) 16.07,13.75 7.48,22.35 arc(6.93,23.17) 6.73,24.14 6.73,59.28 arc(6.56,60.16) 6.05,60.91 3.34,63.62 arc(2.97,64.19) 2.83,64.86 2.83,77.07 arc(3.02,77.65) 3.38,78.14 arc(3.5,78.27) 3.61,78.41 10.06,84.87 arc(10.24,85.13) v1(10.3,85.44) ; v2(75.96,6.06) 76.47,6.57 arc(76.67,6.86) 76.74,7.21 arc(76.74,7.24) 76.74,7.27 arc(76.74,7.32) 76.74,7.36 76.74,8.77 arc(76.7,8.95) 76.59,9.11 76.59,9.13 arc(76.47,9.37) 76.42,9.63 76.42,14.21 arc(76.36,14.61) 76.17,14.97 75.85,15.28 arc(75.68,15.4) 75.49,15.5 arc(75.31,15.58) 75.12,15.64 18.96,15.64 arc(17.99,15.83) 17.16,16.38 10.11,23.44 arc(9.55,24.26) 9.36,25.23 9.36,29.7 arc(9.47,30.23) 9.77,30.68 13.2,34.11 arc(13.75,34.93) 13.94,35.9 13.94,58.77 arc(13.75,59.75) 13.2,60.57 9.01,64.76 arc(8.46,65.58) 8.27,66.55 8.27,72.83 arc(8.07,73.8) 7.52,74.63 7.38,74.77 arc(6.96,75.05) 6.46,75.15 6.45,75.15 arc(5.78,75.28) v1(5.22,75.66) ; v1(11.95,71.34) 13.27,70.02 arc(13.3,70.01) 13.33,70 arc(13.61,69.83) 13.87,69.61 17.68,65.8 arc(18.29,64.89) 18.5,63.81 arc(18.5,63.8) 18.5,63.79 arc(18.5,63.77) 18.5,63.74 18.5,29.36 arc(18.45,29.04) 18.3,28.75 18.3,28.67 17.94,28.31 arc(17.64,28.11) 17.28,28.04 16.96,28.04 arc(16.79,28.07) 16.65,28.16 16.5,28.31 arc(16.1,28.58) v1(15.63,28.67) ; v1(18.17,76.8) 18.21,76.84 18.26,76.84 arc(18.2,76.94) 18.17,77.06 18.17,77.91 arc(17.98,78.88) 17.43,79.71 17.39,79.74 arc(16.57,80.29) 15.6,80.49 10.91,80.49 arc(10.58,80.42) 10.3,80.23 9.94,79.87 arc(9.39,79.05) 9.19,78.07 9.19,67.2 arc(9.41,66.12) 10.01,65.21 14.24,60.99 arc(14.73,60.25) 14.91,59.38 14.91,35.4 arc(14.8,34.72) 14.48,34.1 10.76,30.38 arc(10.44,29.89) 10.33,29.32 10.33,25.63 arc(10.52,24.66) 11.07,23.83 17.77,17.14 arc(18.36,16.74) 19.06,16.6 75.89,16.6 arc(76.35,16.54) 76.77,16.35 77.1,16.02 arc(77.29,15.74) 77.36,15.4 77.36,9.93 arc(77.39,9.76) 77.48,9.62 arc(77.76,9.2) 77.86,8.7 77.86,5.24 arc(77.86,5.24) 77.86,5.24 arc(77.83,5.11) 77.79,4.99 arc(77.76,4.95) 77.73,4.91 77.61,4.8 arc(77.49,4.72) 77.35,4.68 arc(77.34,4.68) 77.32,4.68 arc(76.94,4.62) 76.61,4.44 ; 15.38,66.77 16.91,65.24 arc(17.46,64.42) 17.65,63.45 17.65,30.85 arc(17.62,30.7) 17.54,30.58 arc(17.26,30.39) 16.93,30.32 16.9,30.32 arc(16.08,30.16) 15.39,29.69 v1(15.25,29.56) ; v1(79.42,5.94) 80.28,6.8 arc(80.56,7.22) 80.66,7.72 arc(80.73,8.07) 80.93,8.37 81.06,8.5 arc(81.88,9.05) 82.85,9.24 83.29,9.24 arc(84.26,9.43) 85.08,9.98 85.23,10.13 arc(85.7,10.83) 85.86,11.66 85.86,15.85 arc(85.67,16.83) 85.12,17.65 84.88,17.89 arc(84.28,18.29) 83.58,18.43 19.06,18.43 12.45,25.04 arc(12.23,25.37) 12.16,25.75 12.16,28.08 arc(12.35,29.05) 12.9,29.87 13.49,30.47 arc(14.32,31.02) 15.29,31.21 15.94,31.21 arc(16.11,31.29) 16.26,31.4 arc(16.28,31.42) 16.3,31.44 16.49,31.62 arc(16.63,31.8) 16.73,32 arc(16.76,32.11) 16.79,32.22 arc(16.79,32.29) 16.8,32.36 16.8,61.51 arc(16.6,62.48) 16.05,63.3 10.9,68.46 arc(10.8,68.53) v1(10.68,68.55) ; v1(16.84,93.76) 16.65,93.57 arc(16.52,93.37) 16.47,93.14 16.47,91.28 arc(16.43,91.06) 16.3,90.87 15.26,89.83 arc(14.44,89.28) 13.47,89.09 10.49,89.09 arc(9.52,88.89) 8.7,88.34 1.85,81.49 arc(1.3,80.67) 1.1,79.7 1.1,64.47 arc(1.3,63.5) 1.85,62.67 4.83,59.69 arc(4.96,59.5) 5,59.28 5,23.43 arc(5.2,22.45) 5.75,21.63 15.36,12.02 arc(16.18,11.47) 17.15,11.28 56.11,11.28 arc(56.7,11.16) 57.2,10.83 v1(58.53,9.49) ; v2(76.45,4.47) 76.58,4.47 76.6,4.45 ; v1(10.68,83.66) arc(10.11,83.55) 9.62,83.22 4.26,77.86 arc(4.12,77.69) 3.98,77.54 arc(3.79,77.29) 3.69,77 3.69,64.86 arc(3.75,64.51) 3.95,64.23 6.84,61.33 arc(7.39,60.51) 7.58,59.54 7.58,24.49 arc(7.78,23.52) 8.33,22.7 16.42,14.6 arc(17.25,14.05) 18.22,13.86 70.86,13.86 arc(71.4,13.75) 71.86,13.44 arc(72.14,13.06) 72.28,12.6 72.28,11.27 arc(72.1,10.37) 71.58,9.6 70.12,8.14 arc(69.84,7.71) 69.74,7.21 69.74,6.8 arc(69.75,6.67) 69.78,6.54 70.18,6.14 arc(70.21,6.09) v2(70.26,6.08) ; v1(12.33,87.73) arc(11.77,88.1) 11.11,88.23 10.84,88.23 arc(9.87,88.04) 9.05,87.49 2.7,81.14 arc(2.15,80.32) 1.96,79.35 1.96,64.82 arc(2.15,63.85) 2.7,63.03 5.43,60.29 arc(5.75,59.83) 5.85,59.28 5.85,23.78 arc(6.05,22.81) 6.6,21.98 15.71,12.87 arc(16.53,12.32) 17.5,12.13 67.8,12.13 arc(68.09,12.07) 68.34,11.91 arc(68.53,11.63) 68.59,11.29 68.59,9.47 arc(68.53,9.14) 68.34,8.86 68.33,8.85 arc(67.78,8.03) 67.59,7.06 67.59,5.62 arc(67.39,4.88) v2(66.93,4.26)
  vias: v1(9.62,46.36) v1(9.62,45.35) v1(9.62,44.33) v1(10.63,46.36) v1(10.63,45.35) v1(10.63,44.33) v1(11.65,46.36) v1(11.65,45.35) v1(11.65,44.33) v1(76.55,1.49)
VCC: length 9.9
  Top Layer w0.165: 6.99,42.4 6.99,37.94 arc(6.99,37.93) 6.98,37.93 ; 14.23,42.21 14.23,37.72 arc(14.24,37.69) 14.26,37.68 ; 51.03,5.82 51.89,5.82
  vias: v1(9.66,40.86) v1(9.66,39.85) v1(9.66,38.83) v1(10.68,40.86) v1(10.68,39.85) v1(10.68,38.83) v1(11.7,40.86) v1(11.7,39.85) v1(11.7,38.83) v1(51.07,7.46) v1(51.07,6.83) v1(51.07,6.19) v1(51.07,5.56) v1(51.96,6.83) v1(51.96,6.19) v1(51.94,5.56)
BK_ADDR0: length 4.1
  Top Layer w0.165: 104.35,12.67 R44.2 ; 104.35,12.67 104.35,13.08 arc(104.3,13.34) 104.15,13.56 arc(103.97,13.68) 103.75,13.73 U54.1 ; 104.35,12.67 R43.1
BK_ADDR1: length 7.5
  Top Layer w0.165: 107.71,15.59 107.71,14.88 arc(107.68,14.71) 107.58,14.57 arc(107.36,14.43) 107.1,14.38 U54.2 ; 107.71,15.59 R45.1 ; 107.71,15.59 R46.2
BK_ADDR2: length 6
  Top Layer w0.165: R48.2 105.7,16.8 ; 105.7,16.8 R47.1 ; 105.7,16.8 105.7,15.57 arc(105.66,15.37) 105.55,15.21 arc(105.35,15.07) 105.11,15.03 U54.3
BK_I2C_SCL: length 50.8
  Top Layer w0.165: v1(90.18,13.3) 90.18,14.07 arc(90.17,14.14) R53.1 ; v1(59.35,9.49) 59.35,8.52 arc(59.27,8.15) 59.07,7.84 59.06,7.84 arc(58.82,7.67) U2.PC3
  Inner2 w0.165: v1(90.18,13.3) 90.18,11.56 arc(89.99,10.59) 89.44,9.77 88.89,9.22 arc(88.07,8.67) 87.1,8.48 82.72,8.48 arc(82.22,8.38) 81.8,8.1 arc(81.42,7.53) 81.29,6.87 81.29,3.52 arc(81.11,2.59) 80.57,1.79 79.64,0.86 arc(79.61,0.83) 79.58,0.8 79.54,0.76 arc(79.39,0.64) 79.22,0.58 arc(78.97,0.5) 78.72,0.48 62.27,0.48 arc(61.78,0.58) 61.35,0.86 61.21,1 arc(61.01,1.31) 60.93,1.68 60.93,6.07 arc(60.74,7.04) 60.19,7.87 59.9,8.16 arc(59.49,8.77) v1(59.35,9.49)
BK_I2C_SDA: length 50.6
  Top Layer w0.165: R54.1 v1(89.29,15.46) ; v1(60.01,9.49) 60.01,8.94 arc(59.86,8.21) 59.45,7.59 59.12,7.26 arc(58.85,7.08) U2.PD3
  Inner2 w0.165: 60.05,9.5 60.05,9.18 arc(60.19,8.53) 60.56,7.97 arc(61.06,7.21) 61.24,6.32 61.24,4.15 arc(61.29,3.92) 61.42,3.71 arc(61.72,3.52) 62.06,3.45 62.89,3.45 arc(63.87,3.26) 64.69,2.71 65.69,1.7 arc(66.52,1.15) 67.49,0.96 71.02,0.96 arc(71.08,0.95) 71.13,0.92 arc(71.27,0.82) 71.44,0.79 72.98,0.79 arc(73.1,0.78) 73.22,0.79 78.97,0.79 arc(79,0.79) 79.03,0.79 arc(79.07,0.81) 79.12,0.82 arc(79.13,0.83) 79.15,0.83 arc(79.26,0.88) 79.35,0.94 80.17,1.76 arc(80.72,2.59) 80.91,3.56 80.91,6.82 arc(81.08,7.65) 81.55,8.35 arc(82.11,8.73) 82.77,8.86 86.84,8.86 arc(87.82,9.05) 88.64,9.6 88.79,9.75 arc(89.16,10.31) 89.29,10.97 v1(89.29,15.46)
DP_A_AUXN: length 9.5
  Top Layer w0.165: J1.277 15.25,116.69 arc(15.39,116.72) 15.5,116.8 15.57,116.87 arc(15.68,117.07) 15.83,117.25 arc(15.93,117.41) 15.97,117.59 15.97,119.26 arc(16.16,120.24) 16.71,121.06 18.17,122.52 arc(18.46,122.95) 18.55,123.44 C19.1
DP_A_AUXP: length 9.5
  Top Layer w0.165: J1.279 15.08,117.19 arc(15.24,117.22) 15.38,117.32 15.45,117.39 arc(15.59,117.59) 15.63,117.82 15.63,119.39 arc(15.76,120.19) 16.14,120.9 ; C18.1 16.65,123.42 arc(16.58,123.24) 16.4,123.17 16.14,123.17 arc(15.89,122.92) 16.14,122.66 16.4,122.66 arc(16.58,122.59) 16.65,122.41 16.65,122.12 arc(16.57,121.59) 16.32,121.11 ; 16.32,121.11 arc(16.24,121) 16.14,120.9 ; 16.32,121.11 arc(16.23,121.01) 16.14,120.9
DP_A_HPD: length 4.9
  Top Layer w0.165: J1.276 2.23,116.44 arc(2.13,116.42) 2.04,116.37
DP_A_L0N: length 2.7
  Top Layer w0.165: C27.1 16.25,110.54 arc(16.08,110.65) 15.89,110.69 J1.253
DP_A_L0P: length 5.2
  Top Layer w0.165: J1.255 18.06,111.19 arc(18.19,111.17) 18.3,111.09 arc(18.49,110.81) 18.55,110.48 C26.1
DP_A_L1N: length 15.2
  Top Layer w0.165: J1.259 13.08,112.19 arc(13.02,112.2) 12.97,112.24 arc(12.92,112.27) 12.86,112.28 arc(12.64,112.33) 12.46,112.45 9.77,115.14 arc(9.22,115.96) 9.03,116.93 9.03,116.94 arc(8.96,117.29) 8.76,117.59 6.73,119.62 arc(6.01,120.1) 5.16,120.27 3.83,120.27 arc(3.76,120.25) 3.69,120.21 arc(3.65,120.15) 3.63,120.07 3.63,119.48
DP_A_L1P: length 15.2
  Top Layer w0.165: J1.261 13.08,112.69 arc(13.02,112.68) 12.97,112.65 arc(12.92,112.61) 12.86,112.6 arc(12.76,112.62) 12.69,112.67 10,115.36 arc(9.52,116.08) 9.35,116.93 9.35,116.94 arc(9.25,117.41) 8.98,117.81 6.95,119.84 arc(6.13,120.39) 5.16,120.59 3.83,120.59 arc(3.76,120.6) 3.69,120.65 arc(3.65,120.71) 3.63,120.79 3.63,121.38
DP_A_L2N: length 2.5
  Top Layer w0.165: J1.265 16.34,113.69 arc(16.51,113.73) C23.1
DP_A_L2P: length 4.8
  Top Layer w0.165: J1.267 15.27,114.19 arc(15.54,114.25) 15.76,114.4 arc(15.9,114.49) 16.07,114.52 17.92,114.52 arc(18.04,114.5) 18.14,114.43 18.2,114.37 arc(18.37,114.12) 18.43,113.82
DP_A_L3N: length 4.9
  Top Layer w0.165: J1.271 15.28,115.19 arc(15.4,115.22) 15.51,115.28 16.78,116.55 arc(16.92,116.69) 17.08,116.81 arc(17.67,117.1) 18.33,117.2
DP_A_L3P: length 3.4
  Top Layer w0.165: J1.273 15.25,115.69 arc(15.39,115.72) 15.52,115.8 16.24,116.53 arc(16.53,116.96) 16.63,117.48
FAN1_PWM: length 45.1
  Top Layer w0.165: R55.2 20.66,6.7 arc(20.8,6.79) v1(20.97,6.83) ; 55.19,3.42 55.5,3.42 arc(55.69,3.38) 55.85,3.27 56.04,3.08 arc(56.37,2.59) v1(56.49,2)
  Inner2 w0.165: v1(56.49,2) 56.14,2.35 arc(55.54,2.75) 54.84,2.89 50.12,2.89 arc(49.79,2.82) 49.5,2.63 arc(49.36,2.54) 49.2,2.51 48.85,2.51 arc(48.52,2.57) 48.23,2.76 arc(48.05,3.04) 47.98,3.37 47.98,6.91 arc(47.82,7.69) 47.38,8.35 arc(46.82,8.73) 46.16,8.86 24.05,8.86 arc(23.08,8.67) 22.26,8.11 v1(20.97,6.83)
FAN1_SPEED: length 57.4
  Top Layer w0.165: 60.93,4.02 v2(59.66,4.02) ; U55.3 19.37,3.91 arc(19.38,3.91) 19.39,3.91 ; v1(20.42,3.4) 20.42,3.42 arc(20.37,3.68) 20.22,3.9 arc(20.21,3.9) 20.21,3.9
  Inner2 w0.165: v1(20.42,3.4) 20.42,3.12 arc(20.49,2.79) 20.67,2.51 21.71,1.47 arc(22.53,0.92) 23.51,0.73 25.46,0.73 arc(26.44,0.92) 27.26,1.47 28.19,2.4 arc(28.74,3.22) 28.93,4.19 28.93,6.87 arc(29.05,7.5) 29.41,8.03 29.48,8.1 arc(29.9,8.38) 30.4,8.48 46.21,8.48 arc(46.71,8.38) 47.13,8.1 arc(47.48,7.58) 47.6,6.96 47.6,2.92 arc(47.79,1.95) 48.34,1.13 48.36,1.11 arc(49.06,0.64) 49.89,0.47 55.85,0.47 arc(56.83,0.67) 57.65,1.22 59.11,2.68 arc(59.52,3.29) v2(59.66,4.02)
FAN2_PWM: length 44.8
  Top Layer w0.165: 94.28,8.98 v1(93.07,8.98) ; v1(56.36,1.11) 55.64,1.83 arc(55.4,2.15) 55.26,2.53 arc(55.24,2.68) U2.PL5
  Inner3 w0.165: v1(56.36,1.11) 56.25,1.22 56.13,1.22 arc(56.22,1.13) 56.31,1.05 arc(57.07,0.62) 57.92,0.47 73.72,0.47 arc(74.7,0.67) 75.52,1.22 80.48,6.17 arc(80.68,6.47) 80.75,6.82 80.75,7.48 arc(80.81,7.81) 81,8.09 81.14,8.24 arc(81.97,8.79) 82.94,8.98 v1(93.07,8.98)
FAN2_SPEED: length 48.3
  Top Layer w0.165: v1(92.43,9.62) 96.64,9.62 arc(96.97,9.55) 97.26,9.36 97.4,9.22 arc(97.95,8.4) 98.14,7.42 98.14,6.75 ; v1(60.3,4.67) 60.81,4.67 arc(60.88,4.65) 60.93,4.62
  Inner3 w0.165: v1(92.43,9.62) 88.16,9.62 arc(88,9.59) 87.86,9.49 arc(87.6,9.32) 87.29,9.26 82.71,9.26 arc(81.73,9.06) 80.91,8.51 80.75,8.35 arc(80.46,8.16) 80.13,8.09 79.54,8.09 arc(79.05,8) 78.63,7.72 arc(78.34,7.29) 78.24,6.8 78.24,5.3 arc(78.08,4.48) 77.62,3.78 75.2,1.37 arc(74.63,0.99) 73.97,0.86 73.48,0.86 arc(73.1,0.78) 72.72,0.86 65.37,0.86 arc(64.71,0.99) 64.15,1.37 arc(63.87,1.79) 63.77,2.29 63.77,3.1 arc(63.59,3.96) 63.11,4.69 arc(62.86,4.86) 62.56,4.92 60.91,4.92 arc(60.58,4.85) v1(60.3,4.67)
PCIE_RX_0N: length 140.9
  Top Layer w0.165: J1.148 3.37,84.44 arc(2.51,84.27) 1.79,83.79 arc(1.46,83.29) 1.34,82.7 1.34,27.68 arc(1.52,26.78) 2.03,26.02 arc(2.68,25.59) 3.44,25.44 9.03,25.44 arc(9.4,25.36) 9.72,25.15 arc(9.85,24.96) 9.89,24.73 9.89,20.04 arc(10.09,19.07) 10.64,18.24 16.16,12.72 arc(16.98,12.17) 17.95,11.98 63.22,11.98 arc(63.36,11.97) 63.5,11.94 arc(63.6,11.9) 63.69,11.86 arc(63.81,11.78) 63.92,11.69 63.98,11.62 arc(64.12,11.44) 64.21,11.23 arc(64.23,11.12) 64.24,11.02 64.24,10.19 arc(64.4,9.34) 64.89,8.62 65.69,7.82 arc(66.31,7.4) 67.05,7.26 67.68,7.26
PCIE_RX_0P: length 142.4
  Top Layer w0.165: 67.68,6.66 67.46,6.66 ; 67.46,6.66 67.27,6.66 arc(67.23,6.66) 67.19,6.67 ; 67.46,6.66 arc(67.32,6.66) 67.19,6.67 ; J1.150 3.49,84.94 arc(2.52,84.75) 1.69,84.2 1.66,84.17 arc(1.43,83.89) 1.24,83.57 arc(1.08,83.15) 1.02,82.7 1.02,27.63 arc(1.22,26.66) 1.77,25.83 1.8,25.8 arc(2.56,25.29) 3.44,25.12 9.03,25.12 arc(9.28,25.07) 9.5,24.92 arc(9.56,24.84) 9.58,24.73 9.58,19.91 arc(9.77,18.93) 10.32,18.11 16.03,12.4 arc(16.85,11.85) 17.82,11.66 63.22,11.66 arc(63.48,11.61) 63.7,11.46 63.76,11.4 arc(63.88,11.22) 63.92,11.02 63.92,10.19 arc(64.11,9.22) 64.66,8.4 65.66,7.4 arc(66.11,7.04) 66.62,6.8 arc(66.9,6.72) 67.19,6.67
PCIE_RX_1N: length 137.4
  Top Layer w0.165: J1.142 2.71,82.94 arc(2.49,82.9) 2.3,82.77 arc(2.22,82.66) 2.19,82.52 2.19,27.68 arc(2.31,27.11) 2.63,26.62 arc(3,26.37) 3.44,26.29 9.03,26.29 arc(9.73,26.15) 10.33,25.75 arc(10.64,25.28) 10.75,24.73 10.75,20.39 arc(10.94,19.42) 11.49,18.59 16.51,13.57 arc(17.33,13.02) 18.31,12.83 63.79,12.83 arc(64.3,12.73) 64.73,12.44 65.04,12.13 arc(65.2,11.89) 65.25,11.62 65.25,10.36 arc(65.32,10.03) 65.51,9.75 65.92,9.33 arc(66.38,9.02) 66.93,8.91 arc(67.02,8.93) 67.1,8.99 arc(67.18,9.04) 67.27,9.06 67.68,9.06
PCIE_RX_1P: length 138.6
  Top Layer w0.165: J1.144 2.87,83.44 arc(2.49,83.37) 2.17,83.15 arc(2.05,83.01) 1.96,82.85 arc(1.9,82.69) 1.88,82.52 1.88,27.68 arc(2.01,26.99) 2.41,26.4 arc(2.88,26.08) 3.44,25.97 9.03,25.97 arc(9.61,25.85) 10.1,25.52 arc(10.34,25.16) 10.43,24.73 10.43,20.26 arc(10.62,19.29) 11.17,18.46 16.38,13.26 arc(17.2,12.7) 18.17,12.51 63.79,12.51 arc(64.18,12.43) 64.5,12.22 64.81,11.91 arc(64.9,11.77) 64.93,11.62 64.93,10.36 arc(65.02,9.91) 65.28,9.52 65.7,9.11 arc(66.26,8.73) 66.93,8.6 arc(67.02,8.58) 67.1,8.53 arc(67.18,8.47) 67.27,8.46 67.68,8.46
PCIE_RX_2N: length 145.5
  Top Layer w0.165: 70.98,7.26 v2(70.46,7.26) ; J1.136 9.06,81.44 arc(10.03,81.64) 10.86,82.19 11.19,82.52 arc(11.35,82.63) v1(11.54,82.67)
  Bottom Layer w0.165: v1(11.54,82.67) 11.25,82.67 arc(11.13,82.69) 11.04,82.75 arc(10.95,82.81) 10.83,82.84 10.22,82.84 arc(10.12,82.82) 10.04,82.76 4.34,77.06 arc(4.32,77.04) 4.31,77.01 4.31,74.36 arc(4.31,74.35) 4.31,74.35 arc(4.3,74.31) 4.3,74.26 4.3,74.06 arc(4.31,74.02) 4.31,73.98 ; 72.87,11.01 72.87,12.42 arc(72.72,13.2) 72.28,13.86 arc(71.59,14.32) 70.77,14.48 18.48,14.48 arc(17.51,14.67) 16.68,15.22 8.95,22.96 arc(8.4,23.78) 8.21,24.75 8.21,59.79 arc(8.01,60.77) 7.46,61.59 4.39,64.67 arc(4.33,64.75) 4.31,64.86 4.31,73.98 ; 72.87,11.01 arc(72.87,11.01) 72.87,11.02 ; 72.87,11.01 arc(72.76,10.29) 72.44,9.64 arc(72.42,9.61) 72.4,9.59 70.73,7.92 arc(70.53,7.62) v2(70.46,7.26)
PCIE_RX_2P: length 146.9
  Top Layer w0.165: 70.98,6.66 v2(70.26,6.66) ; J1.138 8.73,81.94 arc(9.65,82.13) 10.43,82.65 10.8,83.01 arc(11.14,83.24) v1(11.54,83.33)
  Bottom Layer w0.165: v1(11.54,83.33) 11.25,83.33 arc(11.13,83.3) 11.04,83.24 arc(10.95,83.18) 10.83,83.15 10.22,83.15 arc(10,83.11) 9.81,82.99 4.1,77.27 arc(4.04,77.18) 3.99,77.08 3.99,74.37 arc(3.99,74.32) 3.99,74.26 3.99,74.06 arc(3.99,74.01) 3.99,73.96 3.99,64.86 arc(4.03,64.63) 4.16,64.44 7.14,61.46 arc(7.7,60.63) 7.89,59.66 7.89,24.62 arc(8.08,23.65) 8.63,22.83 16.55,14.91 arc(17.38,14.36) 18.35,14.16 70.77,14.16 arc(71.46,14.03) 72.05,13.63 arc(72.42,13.08) 72.55,12.42 72.55,11.02 arc(72.45,10.39) 72.18,9.81 70.33,7.97 arc(70.14,7.69) 70.08,7.35 70.08,7.32 arc(70.07,7.26) 70.08,7.19 70.08,6.95 arc(70.1,6.85) 70.16,6.76 v2(70.26,6.66)
PCIE_RX_3N: length 134
  Top Layer w0.165: J1.120 4.34,77.44 arc(3.75,77.33) 3.25,76.99 arc(3.11,76.78) 3.06,76.52 3.06,27.68 arc(3.1,27.44) 3.24,27.23 arc(3.33,27.17) 3.44,27.15 9.09,27.15 arc(10.06,26.96) 10.89,26.41 10.94,26.36 arc(11.43,25.61) 11.61,24.73 11.61,20.75 arc(11.8,19.78) 12.35,18.95 16.87,14.44 arc(17.69,13.89) 18.66,13.69 69.25,13.69 arc(69.87,13.57) 70.4,13.22 70.6,13.02 arc(70.86,12.62) 70.95,12.16 70.95,9.22 arc(70.96,9.18) 70.97,9.15 arc(70.99,9.1) U2.SA6
PCIE_RX_3P: length 135.6
  Top Layer w0.165: J1.122 4.25,77.94 arc(3.79,77.85) 3.4,77.59 3.03,77.22 arc(2.81,76.9) 2.74,76.52 2.74,27.68 arc(2.81,27.32) 3.02,27.01 arc(3.21,26.88) 3.44,26.83 9.03,26.83 arc(9.94,26.65) 10.71,26.14 arc(11.14,25.49) 11.29,24.73 11.29,20.62 arc(11.49,19.64) 12.04,18.82 16.74,14.12 arc(17.56,13.57) 18.53,13.38 69.25,13.38 arc(69.75,13.28) 70.17,12.99 70.38,12.79 arc(70.57,12.5) 70.64,12.16 70.64,10.12 arc(70.62,10.06) 70.59,10 arc(70.45,9.79) 70.4,9.55 70.4,8.86 arc(70.47,8.69) 70.63,8.62 70.73,8.62 arc(70.81,8.6) 70.88,8.56 70.98,8.46
PCIE_RX_4N: length 137.2
  Top Layer w0.165: U2.SB3 75.28,8.56 arc(75.35,8.61) 75.44,8.62 75.53,8.62 arc(75.7,8.69) 75.77,8.86 75.77,11.39 arc(75.85,11.81) 76.09,12.16 arc(76.27,12.44) 76.34,12.77 76.34,13.76 arc(76.31,13.92) 76.21,14.07 76.18,14.1 arc(75.67,14.44) 75.07,14.56 19.02,14.56 arc(18.05,14.75) 17.23,15.3 13.22,19.31 arc(12.67,20.14) 12.48,21.11 12.48,27.13 arc(12.65,27.98) 13.13,28.7 13.48,29.06 arc(13.57,29.12) 13.69,29.14 arc(13.8,29.16) 13.89,29.23 v1(14.1,29.44) ; J1.114 10.45,75.94 arc(10.99,75.84) v1(11.44,75.53)
  Bottom Layer w0.165: v1(14.1,29.44) 14.31,29.65 arc(14.38,29.74) 14.4,29.86 arc(14.42,29.97) 14.49,30.06 14.55,30.13 arc(15.05,30.46) 15.63,30.58 arc(16.22,30.69) 16.72,31.02 16.9,31.21 arc(17.26,31.74) 17.38,32.36 17.38,61.81 arc(17.19,62.79) 16.64,63.61 11.84,68.41 arc(11.36,69.13) 11.19,69.98 11.19,74.92 arc(11.25,75.25) v1(11.44,75.53)
PCIE_RX_4P: length 136.6
  Top Layer w0.165: J1.116 10.61,76.44 arc(10.75,76.47) v1(10.87,76.55) ; U2.SA3 75.18,10.83 arc(75.34,11.64) 75.8,12.32 arc(75.96,12.56) 76.02,12.86 76.02,13.53 arc(75.98,13.75) 75.85,13.94 75.75,14.04 arc(75.42,14.19) 75.07,14.24 18.89,14.24 arc(17.92,14.44) 17.1,14.99 12.9,19.18 arc(12.35,20) 12.16,20.98 12.16,27.13 arc(12.35,28.1) 12.9,28.93 13.26,29.28 arc(13.32,29.38) 13.34,29.49 arc(13.36,29.6) 13.43,29.69 v1(13.64,29.91)
  Bottom Layer w0.165: v1(13.64,29.91) 13.85,30.12 arc(13.94,30.18) 14.05,30.2 arc(14.17,30.22) 14.26,30.29 14.33,30.35 arc(14.93,30.75) 15.63,30.89 arc(16.1,30.99) 16.49,31.25 16.68,31.44 arc(16.96,31.86) 17.06,32.36 17.06,61.81 arc(16.89,62.66) 16.41,63.38 11.62,68.18 arc(11.06,69) 10.87,69.98 v1(10.87,76.55)
